# Altium project FIT_PM12_v1.1.PrjPcb (part 12 of 13)
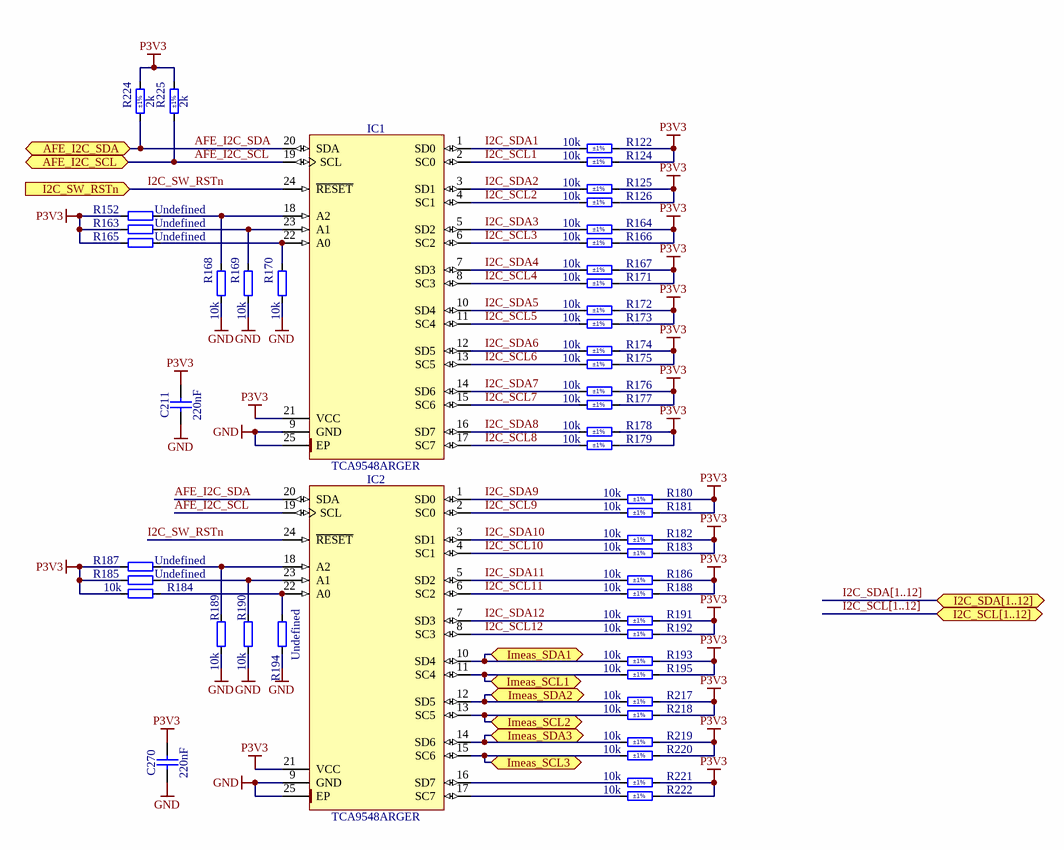
[diagram p35: I2C_Switch.SchDoc]
## Nets that join several sheets
GND: Main_PLL (24 pins), ADCLK (32 pins), PM12_CONN (50 pins), PM12_ATxmega128 (17 pins), PM12_LDO (30 pins), PM12_Supply_LED (22 pins), PM12_P3V8 (19 pins), PM12_P3V3 (15 pins), PM12_N5V5 (10 pins), PM12_P5V5 (23 pins), PM12_P1V0 (15 pins), PM12_P1V8 (15 pins), THS788_1 (35 pins), THS788_3 (35 pins), THS788_2 (35 pins), FPGA_I_J (DD6.P5 DD6.T2 R157.1 R159.1), FPGA_E (60 pins), FPGA_C (21 pins), JTAG (12 pins), FPGA_Power (139 pins), AFE (DD31.3 R4.1 R126#1.1), AFE/INT1 (22 pins), AFE/INT2 (22 pins), AFE/INT3 (22 pins), AFE/INT4 (22 pins), AFE/INT5 (22 pins), AFE/INT6 (22 pins), AFE/INT7 (22 pins), AFE/INT8 (22 pins), AFE/INT9 (22 pins), AFE/INT10 (22 pins), AFE/INT11 (22 pins), AFE/INT12 (22 pins), AFE/ADC1 (22 pins), AFE/ADC2 (22 pins), AFE/ADC3 (22 pins), AFE/ADC4 (22 pins), AFE/ADC5 (22 pins), AFE/ADC6 (22 pins), AFE/ADC7 (22 pins), AFE/ADC8 (22 pins), AFE/ADC9 (22 pins), AFE/ADC10 (22 pins), AFE/ADC11 (22 pins), AFE/ADC12 (22 pins), AFE/CPLD1 (16 pins), AFE/CPLD2 (16 pins), AFE/CPLD3 (16 pins), AFE/CPLD4 (16 pins), AFE/CPLD5 (16 pins), AFE/CPLD6 (16 pins), AFE/CPLD7 (16 pins), AFE/CPLD8 (16 pins), AFE/CPLD9 (16 pins), AFE/CPLD10 (16 pins), AFE/CPLD11 (16 pins), AFE/CPLD12 (16 pins), AFE/QDC1 (15 pins), AFE/QDC2 (14 pins), AFE/QDC3 (14 pins), AFE/QDC4 (13 pins), AFE/QDC5 (15 pins), AFE/QDC6 (14 pins), AFE/QDC7 (14 pins), AFE/QDC8 (13 pins), AFE/QDC9 (15 pins), AFE/QDC10 (14 pins), AFE/QDC11 (14 pins), AFE/QDC12 (13 pins), AFE/ADC_PLL1 (24 pins), AFE/ADC_PLL2 (24 pins), AFE/ADC_PLL3 (24 pins), AFE/ADC_PLL4 (24 pins), AFE/ADC_PLL5 (24 pins), AFE/ADC_PLL6 (24 pins), AFE/ADC_PLL7 (24 pins), AFE/ADC_PLL8 (24 pins), AFE/ADC_PLL9 (24 pins), AFE/ADC_PLL10 (24 pins), AFE/ADC_PLL11 (24 pins), AFE/ADC_PLL12 (24 pins), AFE/Gate_Strobe1 (17 pins), AFE/Gate_Strobe2 (17 pins), AFE/Gate_Strobe3 (17 pins), AFE/Gate_Strobe4 (17 pins), AFE/Gate_Strobe5 (17 pins), AFE/Gate_Strobe6 (17 pins), AFE/Gate_Strobe7 (17 pins), AFE/Gate_Strobe8 (17 pins), AFE/Gate_Strobe9 (17 pins), AFE/Gate_Strobe10 (17 pins), AFE/Gate_Strobe11 (17 pins), AFE/Gate_Strobe12 (17 pins), I2C_Switch (12 pins)
N5V5: PM12_N5V5 (17 pins), PM12_P5V5 (X7.6 X7.7 X7.8)
P1V0: PM12_P1V0 (R74.2), FPGA_Power (27 pins)
P1V0_LDO: PM12_LDO (C78.2 R53.2), FPGA_Power (5 pins)
P1V0_LDO_2: PM12_LDO (C80.2 DA3.4 R53.1), PM12_Supply_LED (R100.1)
P1V2_LDO: PM12_LDO (C84.2 R55.2), FPGA_I_J (DD6.M5 R24.1), FPGA_Power (7 pins)
P1V2_LDO_2: PM12_LDO (C81.2 DA4.4 R55.1), PM12_Supply_LED (R103.1)
P1V8: ADCLK (30 pins), PM12_P1V8 (R84.2), FPGA_Power (52 pins), AFE/CPLD1 (8 pins), AFE/CPLD2 (8 pins), AFE/CPLD3 (8 pins), AFE/CPLD4 (8 pins), AFE/CPLD5 (8 pins), AFE/CPLD6 (8 pins), AFE/CPLD7 (8 pins), AFE/CPLD8 (8 pins), AFE/CPLD9 (8 pins), AFE/CPLD10 (8 pins), AFE/CPLD11 (8 pins), AFE/CPLD12 (8 pins), AFE/Gate_Strobe1 (R3A.2), AFE/Gate_Strobe2 (R3B.2), AFE/Gate_Strobe3 (R3C.2), AFE/Gate_Strobe4 (R3D.2), AFE/Gate_Strobe5 (R3E.2), AFE/Gate_Strobe6 (R3F.2), AFE/Gate_Strobe7 (R3G.2), AFE/Gate_Strobe8 (R3H.2), AFE/Gate_Strobe9 (R3I.2), AFE/Gate_Strobe10 (R3J.2), AFE/Gate_Strobe11 (R3K.2), AFE/Gate_Strobe12 (R3L.2)
P1V8_2: PM12_LDO (L7.1), PM12_P1V8 (7 pins)
P1V8_LDO: PM12_LDO (C86.2 R56.2), FPGA_Power (DD6.N6)
P1V8_LDO_2: PM12_LDO (C85.2 DA5.4 DA5.5 R56.1), PM12_Supply_LED (R106.1)
P3V3: Main_PLL (22 pins), PM12_CONN (12 pins), PM12_ATxmega128 (9 pins), PM12_LDO (13 pins), PM12_Supply_LED (18 pins), PM12_P3V8 (7 pins), PM12_P3V3 (8 pins), PM12_P5V5 (C122.2 DA7.19), PM12_P1V0 (8 pins), PM12_P1V8 (8 pins), THS788_1 (33 pins), THS788_3 (33 pins), THS788_2 (33 pins), FPGA_I_J (DD6.P7 DD6.T5 R156.2 R158.2), FPGA_C (VD1.2 VD2.2 VD3.2 VD7.2), JTAG (5 pins), FPGA_Power (17 pins), AFE (DD31.5 R124#1.2 R125#1.2), AFE/ADC1 (C120A.2 C121A.2 DA10A.24 DA19A.24), AFE/ADC2 (C120B.2 C121B.2 DA10B.24 DA19B.24), AFE/ADC3 (C120C.2 C121C.2 DA10C.24 DA19C.24), AFE/ADC4 (C120D.2 C121D.2 DA10D.24 DA19D.24), AFE/ADC5 (C120E.2 C121E.2 DA10E.24 DA19E.24), AFE/ADC6 (C120F.2 C121F.2 DA10F.24 DA19F.24), AFE/ADC7 (C120G.2 C121G.2 DA10G.24 DA19G.24), AFE/ADC8 (C120H.2 C121H.2 DA10H.24 DA19H.24), AFE/ADC9 (C120I.2 C121I.2 DA10I.24 DA19I.24), AFE/ADC10 (C120J.2 C121J.2 DA10J.24 DA19J.24), AFE/ADC11 (C120K.2 C121K.2 DA10K.24 DA19K.24), AFE/ADC12 (C120L.2 C121L.2 DA10L.24 DA19L.24), AFE/CPLD1 (8 pins), AFE/CPLD2 (8 pins), AFE/CPLD3 (8 pins), AFE/CPLD4 (8 pins), AFE/CPLD5 (8 pins), AFE/CPLD6 (8 pins), AFE/CPLD7 (8 pins), AFE/CPLD8 (8 pins), AFE/CPLD9 (8 pins), AFE/CPLD10 (8 pins), AFE/CPLD11 (8 pins), AFE/CPLD12 (8 pins), AFE/QDC1 (DA22A.12), AFE/QDC2 (DA22B.12 DA22B.13), AFE/QDC3 (DA22C.12 DA22C.14), AFE/QDC4 (DA22D.12 DA22D.13 DA22D.14), AFE/QDC5 (DA22E.12), AFE/QDC6 (DA22F.12 DA22F.13), AFE/QDC7 (DA22G.12 DA22G.14), AFE/QDC8 (DA22H.12 DA22H.13 DA22H.14), AFE/QDC9 (DA22I.12), AFE/QDC10 (DA22J.12 DA22J.13), AFE/QDC11 (DA22K.12 DA22K.14), AFE/QDC12 (DA22L.12 DA22L.13 DA22L.14), AFE/ADC_PLL1 (20 pins), AFE/ADC_PLL2 (20 pins), AFE/ADC_PLL3 (20 pins), AFE/ADC_PLL4 (20 pins), AFE/ADC_PLL5 (20 pins), AFE/ADC_PLL6 (20 pins), AFE/ADC_PLL7 (20 pins), AFE/ADC_PLL8 (20 pins), AFE/ADC_PLL9 (20 pins), AFE/ADC_PLL10 (20 pins), AFE/ADC_PLL11 (20 pins), AFE/ADC_PLL12 (20 pins), AFE/Gate_Strobe1 (9 pins), AFE/Gate_Strobe2 (9 pins), AFE/Gate_Strobe3 (9 pins), AFE/Gate_Strobe4 (9 pins), AFE/Gate_Strobe5 (9 pins), AFE/Gate_Strobe6 (9 pins), AFE/Gate_Strobe7 (9 pins), AFE/Gate_Strobe8 (9 pins), AFE/Gate_Strobe9 (9 pins), AFE/Gate_Strobe10 (9 pins), AFE/Gate_Strobe11 (9 pins), AFE/Gate_Strobe12 (9 pins), I2C_Switch (44 pins)
P3V3_2: PM12_LDO (L8.1), PM12_P3V3 (7 pins)
P3V3_LDO: PM12_CONN (C61.2 C261.2 DD7.16), PM12_ATxmega128 (20 pins), PM12_LDO (C254.1 DA25.3)
P3V8: PM12_P3V8 (C205.1 C267.1 C268.1 L14.2), AFE/Gate_Strobe1 (L1A.1), AFE/Gate_Strobe2 (L1B.1), AFE/Gate_Strobe3 (L1C.1), AFE/Gate_Strobe4 (L1D.1), AFE/Gate_Strobe5 (L1E.1), AFE/Gate_Strobe6 (L1F.1), AFE/Gate_Strobe7 (L1G.1), AFE/Gate_Strobe8 (L1H.1), AFE/Gate_Strobe9 (L1I.1), AFE/Gate_Strobe10 (L1J.1), AFE/Gate_Strobe11 (L1K.1), AFE/Gate_Strobe12 (L1L.1)
VIN_P12V0: PM12_LDO (C2.1 R110.2 X15.4), PM12_N5V5 (5 pins), PM12_P5V5 (C4.2 C118.2 DA7.6 DA7.7)
ADC_CLK: AFE/ADC1 (DA10A.13 DA19A.13), AFE/CPLD1 (DD18A.27), AFE/ADC_PLL1 (DD21A.20)
ADC_CLK: AFE/ADC2 (DA10B.13 DA19B.13), AFE/CPLD2 (DD18B.27), AFE/ADC_PLL2 (DD21B.20)
ADC_CLK: AFE/ADC3 (DA10C.13 DA19C.13), AFE/CPLD3 (DD18C.27), AFE/ADC_PLL3 (DD21C.20)
ADC_CLK: AFE/ADC4 (DA10D.13 DA19D.13), AFE/CPLD4 (DD18D.27), AFE/ADC_PLL4 (DD21D.20)
ADC_CLK: AFE/ADC5 (DA10E.13 DA19E.13), AFE/CPLD5 (DD18E.27), AFE/ADC_PLL5 (DD21E.20)
ADC_CLK: AFE/ADC6 (DA10F.13 DA19F.13), AFE/CPLD6 (DD18F.27), AFE/ADC_PLL6 (DD21F.20)
ADC_CLK: AFE/ADC7 (DA10G.13 DA19G.13), AFE/CPLD7 (DD18G.27), AFE/ADC_PLL7 (DD21G.20)
ADC_CLK: AFE/ADC8 (DA10H.13 DA19H.13), AFE/CPLD8 (DD18H.27), AFE/ADC_PLL8 (DD21H.20)
ADC_CLK: AFE/ADC9 (DA10I.13 DA19I.13), AFE/CPLD9 (DD18I.27), AFE/ADC_PLL9 (DD21I.20)
ADC_CLK: AFE/ADC10 (DA10J.13 DA19J.13), AFE/CPLD10 (DD18J.27), AFE/ADC_PLL10 (DD21J.20)
ADC_CLK: AFE/ADC11 (DA10K.13 DA19K.13), AFE/CPLD11 (DD18K.27), AFE/ADC_PLL11 (DD21K.20)
ADC_CLK: AFE/ADC12 (DA10L.13 DA19L.13), AFE/CPLD12 (DD18L.27), AFE/ADC_PLL12 (DD21L.20)
ADC_CLK_DELAY: AFE/QDC1 (DA22A.1), AFE/ADC_PLL1 (R57A.2)
ADC_CLK_DELAY: AFE/QDC2 (DA22B.1), AFE/ADC_PLL2 (R57B.2)
ADC_CLK_DELAY: AFE/QDC3 (DA22C.1), AFE/ADC_PLL3 (R57C.2)
ADC_CLK_DELAY: AFE/QDC4 (DA22D.1), AFE/ADC_PLL4 (R57D.2)
ADC_CLK_DELAY: AFE/QDC5 (DA22E.1), AFE/ADC_PLL5 (R57E.2)
ADC_CLK_DELAY: AFE/QDC6 (DA22F.1), AFE/ADC_PLL6 (R57F.2)
ADC_CLK_DELAY: AFE/QDC7 (DA22G.1), AFE/ADC_PLL7 (R57G.2)
ADC_CLK_DELAY: AFE/QDC8 (DA22H.1), AFE/ADC_PLL8 (R57H.2)
ADC_CLK_DELAY: AFE/QDC9 (DA22I.1), AFE/ADC_PLL9 (R57I.2)
ADC_CLK_DELAY: AFE/QDC10 (DA22J.1), AFE/ADC_PLL10 (R57J.2)
ADC_CLK_DELAY: AFE/QDC11 (DA22K.1), AFE/ADC_PLL11 (R57K.2)
ADC_CLK_DELAY: AFE/QDC12 (DA22L.1), AFE/ADC_PLL12 (R57L.2)
ADC_PLL_PWRDNB: PM12_ATxmega128 (DD5.19), AFE/ADC_PLL1 (DD21A.12), AFE/ADC_PLL2 (DD21B.12), AFE/ADC_PLL3 (DD21C.12), AFE/ADC_PLL4 (DD21D.12), AFE/ADC_PLL5 (DD21E.12), AFE/ADC_PLL6 (DD21F.12), AFE/ADC_PLL7 (DD21G.12), AFE/ADC_PLL8 (DD21H.12), AFE/ADC_PLL9 (DD21I.12), AFE/ADC_PLL10 (DD21J.12), AFE/ADC_PLL11 (DD21K.12), AFE/ADC_PLL12 (DD21L.12)
ADC_VREF: AFE/ADC1 (C44A.2 C55A.2 DA10A.4 DA19A.4), AFE/QDC1 (5 pins)
ADC_VREF: AFE/ADC2 (C44B.2 C55B.2 DA10B.4 DA19B.4), AFE/QDC2 (5 pins)
ADC_VREF: AFE/ADC3 (C44C.2 C55C.2 DA10C.4 DA19C.4), AFE/QDC3 (5 pins)
ADC_VREF: AFE/ADC4 (C44D.2 C55D.2 DA10D.4 DA19D.4), AFE/QDC4 (5 pins)
ADC_VREF: AFE/ADC5 (C44E.2 C55E.2 DA10E.4 DA19E.4), AFE/QDC5 (5 pins)
ADC_VREF: AFE/ADC6 (C44F.2 C55F.2 DA10F.4 DA19F.4), AFE/QDC6 (5 pins)
ADC_VREF: AFE/ADC7 (C44G.2 C55G.2 DA10G.4 DA19G.4), AFE/QDC7 (5 pins)
ADC_VREF: AFE/ADC8 (C44H.2 C55H.2 DA10H.4 DA19H.4), AFE/QDC8 (5 pins)
ADC_VREF: AFE/ADC9 (C44I.2 C55I.2 DA10I.4 DA19I.4), AFE/QDC9 (5 pins)
ADC_VREF: AFE/ADC10 (C44J.2 C55J.2 DA10J.4 DA19J.4), AFE/QDC10 (5 pins)
ADC_VREF: AFE/ADC11 (C44K.2 C55K.2 DA10K.4 DA19K.4), AFE/QDC11 (5 pins)
ADC_VREF: AFE/ADC12 (C44L.2 C55L.2 DA10L.4 DA19L.4), AFE/QDC12 (5 pins)
ADCA_D0: AFE/ADC1 (DA10A.15), AFE/CPLD1 (DD18A.35)
ADCA_D0: AFE/ADC2 (DA10B.15), AFE/CPLD2 (DD18B.35)
ADCA_D0: AFE/ADC3 (DA10C.15), AFE/CPLD3 (DD18C.35)
ADCA_D0: AFE/ADC4 (DA10D.15), AFE/CPLD4 (DD18D.35)
ADCA_D0: AFE/ADC5 (DA10E.15), AFE/CPLD5 (DD18E.35)
ADCA_D0: AFE/ADC6 (DA10F.15), AFE/CPLD6 (DD18F.35)
ADCA_D0: AFE/ADC7 (DA10G.15), AFE/CPLD7 (DD18G.35)
ADCA_D0: AFE/ADC8 (DA10H.15), AFE/CPLD8 (DD18H.35)
ADCA_D0: AFE/ADC9 (DA10I.15), AFE/CPLD9 (DD18I.35)
ADCA_D0: AFE/ADC10 (DA10J.15), AFE/CPLD10 (DD18J.35)
ADCA_D0: AFE/ADC11 (DA10K.15), AFE/CPLD11 (DD18K.35)
ADCA_D0: AFE/ADC12 (DA10L.15), AFE/CPLD12 (DD18L.35)
ADCA_D1: AFE/ADC1 (DA10A.16), AFE/CPLD1 (DD18A.34)
ADCA_D1: AFE/ADC2 (DA10B.16), AFE/CPLD2 (DD18B.34)
ADCA_D1: AFE/ADC3 (DA10C.16), AFE/CPLD3 (DD18C.34)
ADCA_D1: AFE/ADC4 (DA10D.16), AFE/CPLD4 (DD18D.34)
ADCA_D1: AFE/ADC5 (DA10E.16), AFE/CPLD5 (DD18E.34)
ADCA_D1: AFE/ADC6 (DA10F.16), AFE/CPLD6 (DD18F.34)
ADCA_D1: AFE/ADC7 (DA10G.16), AFE/CPLD7 (DD18G.34)
ADCA_D1: AFE/ADC8 (DA10H.16), AFE/CPLD8 (DD18H.34)
ADCA_D1: AFE/ADC9 (DA10I.16), AFE/CPLD9 (DD18I.34)
ADCA_D1: AFE/ADC10 (DA10J.16), AFE/CPLD10 (DD18J.34)
ADCA_D1: AFE/ADC11 (DA10K.16), AFE/CPLD11 (DD18K.34)
ADCA_D1: AFE/ADC12 (DA10L.16), AFE/CPLD12 (DD18L.34)
ADCA_D2: AFE/ADC1 (DA10A.17), AFE/CPLD1 (DD18A.33)
ADCA_D2: AFE/ADC2 (DA10B.17), AFE/CPLD2 (DD18B.33)
ADCA_D2: AFE/ADC3 (DA10C.17), AFE/CPLD3 (DD18C.33)
ADCA_D2: AFE/ADC4 (DA10D.17), AFE/CPLD4 (DD18D.33)
ADCA_D2: AFE/ADC5 (DA10E.17), AFE/CPLD5 (DD18E.33)
ADCA_D2: AFE/ADC6 (DA10F.17), AFE/CPLD6 (DD18F.33)
ADCA_D2: AFE/ADC7 (DA10G.17), AFE/CPLD7 (DD18G.33)
ADCA_D2: AFE/ADC8 (DA10H.17), AFE/CPLD8 (DD18H.33)
ADCA_D2: AFE/ADC9 (DA10I.17), AFE/CPLD9 (DD18I.33)
ADCA_D2: AFE/ADC10 (DA10J.17), AFE/CPLD10 (DD18J.33)
ADCA_D2: AFE/ADC11 (DA10K.17), AFE/CPLD11 (DD18K.33)
ADCA_D2: AFE/ADC12 (DA10L.17), AFE/CPLD12 (DD18L.33)
ADCA_D3: AFE/ADC1 (DA10A.18), AFE/CPLD1 (DD18A.32)
ADCA_D3: AFE/ADC2 (DA10B.18), AFE/CPLD2 (DD18B.32)
ADCA_D3: AFE/ADC3 (DA10C.18), AFE/CPLD3 (DD18C.32)
ADCA_D3: AFE/ADC4 (DA10D.18), AFE/CPLD4 (DD18D.32)
ADCA_D3: AFE/ADC5 (DA10E.18), AFE/CPLD5 (DD18E.32)
ADCA_D3: AFE/ADC6 (DA10F.18), AFE/CPLD6 (DD18F.32)
ADCA_D3: AFE/ADC7 (DA10G.18), AFE/CPLD7 (DD18G.32)
ADCA_D3: AFE/ADC8 (DA10H.18), AFE/CPLD8 (DD18H.32)
ADCA_D3: AFE/ADC9 (DA10I.18), AFE/CPLD9 (DD18I.32)
ADCA_D3: AFE/ADC10 (DA10J.18), AFE/CPLD10 (DD18J.32)
ADCA_D3: AFE/ADC11 (DA10K.18), AFE/CPLD11 (DD18K.32)
ADCA_D3: AFE/ADC12 (DA10L.18), AFE/CPLD12 (DD18L.32)
ADCA_D4: AFE/ADC1 (DA10A.19), AFE/CPLD1 (DD18A.30)
ADCA_D4: AFE/ADC2 (DA10B.19), AFE/CPLD2 (DD18B.30)
ADCA_D4: AFE/ADC3 (DA10C.19), AFE/CPLD3 (DD18C.30)
ADCA_D4: AFE/ADC4 (DA10D.19), AFE/CPLD4 (DD18D.30)
ADCA_D4: AFE/ADC5 (DA10E.19), AFE/CPLD5 (DD18E.30)
ADCA_D4: AFE/ADC6 (DA10F.19), AFE/CPLD6 (DD18F.30)
ADCA_D4: AFE/ADC7 (DA10G.19), AFE/CPLD7 (DD18G.30)
ADCA_D4: AFE/ADC8 (DA10H.19), AFE/CPLD8 (DD18H.30)
ADCA_D4: AFE/ADC9 (DA10I.19), AFE/CPLD9 (DD18I.30)
ADCA_D4: AFE/ADC10 (DA10J.19), AFE/CPLD10 (DD18J.30)
ADCA_D4: AFE/ADC11 (DA10K.19), AFE/CPLD11 (DD18K.30)
ADCA_D4: AFE/ADC12 (DA10L.19), AFE/CPLD12 (DD18L.30)
ADCA_D5: AFE/ADC1 (DA10A.20), AFE/CPLD1 (DD18A.29)
ADCA_D5: AFE/ADC2 (DA10B.20), AFE/CPLD2 (DD18B.29)
ADCA_D5: AFE/ADC3 (DA10C.20), AFE/CPLD3 (DD18C.29)
ADCA_D5: AFE/ADC4 (DA10D.20), AFE/CPLD4 (DD18D.29)
ADCA_D5: AFE/ADC5 (DA10E.20), AFE/CPLD5 (DD18E.29)
ADCA_D5: AFE/ADC6 (DA10F.20), AFE/CPLD6 (DD18F.29)
ADCA_D5: AFE/ADC7 (DA10G.20), AFE/CPLD7 (DD18G.29)
ADCA_D5: AFE/ADC8 (DA10H.20), AFE/CPLD8 (DD18H.29)
ADCA_D5: AFE/ADC9 (DA10I.20), AFE/CPLD9 (DD18I.29)
ADCA_D5: AFE/ADC10 (DA10J.20), AFE/CPLD10 (DD18J.29)
ADCA_D5: AFE/ADC11 (DA10K.20), AFE/CPLD11 (DD18K.29)
ADCA_D5: AFE/ADC12 (DA10L.20), AFE/CPLD12 (DD18L.29)
ADCA_D6: AFE/ADC1 (DA10A.21), AFE/CPLD1 (DD18A.28)
ADCA_D6: AFE/ADC2 (DA10B.21), AFE/CPLD2 (DD18B.28)
ADCA_D6: AFE/ADC3 (DA10C.21), AFE/CPLD3 (DD18C.28)
ADCA_D6: AFE/ADC4 (DA10D.21), AFE/CPLD4 (DD18D.28)
ADCA_D6: AFE/ADC5 (DA10E.21), AFE/CPLD5 (DD18E.28)
ADCA_D6: AFE/ADC6 (DA10F.21), AFE/CPLD6 (DD18F.28)
ADCA_D6: AFE/ADC7 (DA10G.21), AFE/CPLD7 (DD18G.28)
ADCA_D6: AFE/ADC8 (DA10H.21), AFE/CPLD8 (DD18H.28)
ADCA_D6: AFE/ADC9 (DA10I.21), AFE/CPLD9 (DD18I.28)
ADCA_D6: AFE/ADC10 (DA10J.21), AFE/CPLD10 (DD18J.28)
ADCA_D6: AFE/ADC11 (DA10K.21), AFE/CPLD11 (DD18K.28)
ADCA_D6: AFE/ADC12 (DA10L.21), AFE/CPLD12 (DD18L.28)
ADCA_D7: AFE/ADC1 (DA10A.22), AFE/CPLD1 (DD18A.23)
ADCA_D7: AFE/ADC2 (DA10B.22), AFE/CPLD2 (DD18B.23)
ADCA_D7: AFE/ADC3 (DA10C.22), AFE/CPLD3 (DD18C.23)
ADCA_D7: AFE/ADC4 (DA10D.22), AFE/CPLD4 (DD18D.23)
ADCA_D7: AFE/ADC5 (DA10E.22), AFE/CPLD5 (DD18E.23)
ADCA_D7: AFE/ADC6 (DA10F.22), AFE/CPLD6 (DD18F.23)
ADCA_D7: AFE/ADC7 (DA10G.22), AFE/CPLD7 (DD18G.23)
ADCA_D7: AFE/ADC8 (DA10H.22), AFE/CPLD8 (DD18H.23)
ADCA_D7: AFE/ADC9 (DA10I.22), AFE/CPLD9 (DD18I.23)
ADCA_D7: AFE/ADC10 (DA10J.22), AFE/CPLD10 (DD18J.23)
ADCA_D7: AFE/ADC11 (DA10K.22), AFE/CPLD11 (DD18K.23)
ADCA_D7: AFE/ADC12 (DA10L.22), AFE/CPLD12 (DD18L.23)
ADCA_D8: AFE/ADC1 (DA10A.25), AFE/CPLD1 (DD18A.24)
ADCA_D8: AFE/ADC2 (DA10B.25), AFE/CPLD2 (DD18B.24)
ADCA_D8: AFE/ADC3 (DA10C.25), AFE/CPLD3 (DD18C.24)
ADCA_D8: AFE/ADC4 (DA10D.25), AFE/CPLD4 (DD18D.24)
ADCA_D8: AFE/ADC5 (DA10E.25), AFE/CPLD5 (DD18E.24)
ADCA_D8: AFE/ADC6 (DA10F.25), AFE/CPLD6 (DD18F.24)
ADCA_D8: AFE/ADC7 (DA10G.25), AFE/CPLD7 (DD18G.24)
ADCA_D8: AFE/ADC8 (DA10H.25), AFE/CPLD8 (DD18H.24)
ADCA_D8: AFE/ADC9 (DA10I.25), AFE/CPLD9 (DD18I.24)
ADCA_D8: AFE/ADC10 (DA10J.25), AFE/CPLD10 (DD18J.24)
ADCA_D8: AFE/ADC11 (DA10K.25), AFE/CPLD11 (DD18K.24)
ADCA_D8: AFE/ADC12 (DA10L.25), AFE/CPLD12 (DD18L.24)
ADCA_D9: AFE/ADC1 (DA10A.26), AFE/CPLD1 (DD18A.22)
ADCA_D9: AFE/ADC2 (DA10B.26), AFE/CPLD2 (DD18B.22)
ADCA_D9: AFE/ADC3 (DA10C.26), AFE/CPLD3 (DD18C.22)
ADCA_D9: AFE/ADC4 (DA10D.26), AFE/CPLD4 (DD18D.22)
ADCA_D9: AFE/ADC5 (DA10E.26), AFE/CPLD5 (DD18E.22)
ADCA_D9: AFE/ADC6 (DA10F.26), AFE/CPLD6 (DD18F.22)
ADCA_D9: AFE/ADC7 (DA10G.26), AFE/CPLD7 (DD18G.22)
ADCA_D9: AFE/ADC8 (DA10H.26), AFE/CPLD8 (DD18H.22)
ADCA_D9: AFE/ADC9 (DA10I.26), AFE/CPLD9 (DD18I.22)
ADCA_D9: AFE/ADC10 (DA10J.26), AFE/CPLD10 (DD18J.22)
ADCA_D9: AFE/ADC11 (DA10K.26), AFE/CPLD11 (DD18K.22)
ADCA_D9: AFE/ADC12 (DA10L.26), AFE/CPLD12 (DD18L.22)
ADCA_D10_: AFE/ADC1 (DA10A.27), AFE/CPLD1 (DD18A.19)
ADCA_D10_: AFE/ADC2 (DA10B.27), AFE/CPLD2 (DD18B.19)
ADCA_D10_: AFE/ADC3 (DA10C.27), AFE/CPLD3 (DD18C.19)
ADCA_D10_: AFE/ADC4 (DA10D.27), AFE/CPLD4 (DD18D.19)
ADCA_D10_: AFE/ADC5 (DA10E.27), AFE/CPLD5 (DD18E.19)
ADCA_D10_: AFE/ADC6 (DA10F.27), AFE/CPLD6 (DD18F.19)
ADCA_D10_: AFE/ADC7 (DA10G.27), AFE/CPLD7 (DD18G.19)
ADCA_D10_: AFE/ADC8 (DA10H.27), AFE/CPLD8 (DD18H.19)
ADCA_D10_: AFE/ADC9 (DA10I.27), AFE/CPLD9 (DD18I.19)
ADCA_D10_: AFE/ADC10 (DA10J.27), AFE/CPLD10 (DD18J.19)
ADCA_D10_: AFE/ADC11 (DA10K.27), AFE/CPLD11 (DD18K.19)
ADCA_D10_: AFE/ADC12 (DA10L.27), AFE/CPLD12 (DD18L.19)
ADCA_D11_: AFE/ADC1 (DA10A.28), AFE/CPLD1 (DD18A.18)
ADCA_D11_: AFE/ADC2 (DA10B.28), AFE/CPLD2 (DD18B.18)
ADCA_D11_: AFE/ADC3 (DA10C.28), AFE/CPLD3 (DD18C.18)
ADCA_D11_: AFE/ADC4 (DA10D.28), AFE/CPLD4 (DD18D.18)
ADCA_D11_: AFE/ADC5 (DA10E.28), AFE/CPLD5 (DD18E.18)
ADCA_D11_: AFE/ADC6 (DA10F.28), AFE/CPLD6 (DD18F.18)
ADCA_D11_: AFE/ADC7 (DA10G.28), AFE/CPLD7 (DD18G.18)
ADCA_D11_: AFE/ADC8 (DA10H.28), AFE/CPLD8 (DD18H.18)
ADCA_D11_: AFE/ADC9 (DA10I.28), AFE/CPLD9 (DD18I.18)
ADCA_D11_: AFE/ADC10 (DA10J.28), AFE/CPLD10 (DD18J.18)
ADCA_D11_: AFE/ADC11 (DA10K.28), AFE/CPLD11 (DD18K.18)
ADCA_D11_: AFE/ADC12 (DA10L.28), AFE/CPLD12 (DD18L.18)
ADCA_VIN_N: AFE/INT1 (C154A.2 R12A.2), AFE/ADC1 (DA10A.10)
ADCA_VIN_N: AFE/INT2 (C154B.2 R12B.2), AFE/ADC2 (DA10B.10)
ADCA_VIN_N: AFE/INT3 (C154C.2 R12C.2), AFE/ADC3 (DA10C.10)
ADCA_VIN_N: AFE/INT4 (C154D.2 R12D.2), AFE/ADC4 (DA10D.10)
ADCA_VIN_N: AFE/INT5 (C154E.2 R12E.2), AFE/ADC5 (DA10E.10)
ADCA_VIN_N: AFE/INT6 (C154F.2 R12F.2), AFE/ADC6 (DA10F.10)
ADCA_VIN_N: AFE/INT7 (C154G.2 R12G.2), AFE/ADC7 (DA10G.10)
ADCA_VIN_N: AFE/INT8 (C154H.2 R12H.2), AFE/ADC8 (DA10H.10)
ADCA_VIN_N: AFE/INT9 (C154I.2 R12I.2), AFE/ADC9 (DA10I.10)
ADCA_VIN_N: AFE/INT10 (C154J.2 R12J.2), AFE/ADC10 (DA10J.10)
ADCA_VIN_N: AFE/INT11 (C154K.2 R12K.2), AFE/ADC11 (DA10K.10)
ADCA_VIN_N: AFE/INT12 (C154L.2 R12L.2), AFE/ADC12 (DA10L.10)
ADCA_VIN_P: AFE/INT1 (C153A.2 R11_QCD1A.2), AFE/ADC1 (DA10A.9)
ADCA_VIN_P: AFE/INT2 (C153B.2 R11_QCD1B.2), AFE/ADC2 (DA10B.9)
ADCA_VIN_P: AFE/INT3 (C153C.2 R11_QCD1C.2), AFE/ADC3 (DA10C.9)
ADCA_VIN_P: AFE/INT4 (C153D.2 R11_QCD1D.2), AFE/ADC4 (DA10D.9)
ADCA_VIN_P: AFE/INT5 (C153E.2 R11_QCD1E.2), AFE/ADC5 (DA10E.9)
ADCA_VIN_P: AFE/INT6 (C153F.2 R11_QCD1F.2), AFE/ADC6 (DA10F.9)
ADCA_VIN_P: AFE/INT7 (C153G.2 R11_QCD1G.2), AFE/ADC7 (DA10G.9)
ADCA_VIN_P: AFE/INT8 (C153H.2 R11_QCD1H.2), AFE/ADC8 (DA10H.9)
ADCA_VIN_P: AFE/INT9 (C153I.2 R11_QCD1I.2), AFE/ADC9 (DA10I.9)
ADCA_VIN_P: AFE/INT10 (C153J.2 R11_QCD1J.2), AFE/ADC10 (DA10J.9)
ADCA_VIN_P: AFE/INT11 (C153K.2 R11_QCD1K.2), AFE/ADC11 (DA10K.9)
ADCA_VIN_P: AFE/INT12 (C153L.2 R11_QCD1L.2), AFE/ADC12 (DA10L.9)
ADCB_D0: AFE/ADC1 (DA19A.15), AFE/CPLD1 (DD18A.52)
ADCB_D0: AFE/ADC2 (DA19B.15), AFE/CPLD2 (DD18B.52)
ADCB_D0: AFE/ADC3 (DA19C.15), AFE/CPLD3 (DD18C.52)
ADCB_D0: AFE/ADC4 (DA19D.15), AFE/CPLD4 (DD18D.52)
ADCB_D0: AFE/ADC5 (DA19E.15), AFE/CPLD5 (DD18E.52)
ADCB_D0: AFE/ADC6 (DA19F.15), AFE/CPLD6 (DD18F.52)
ADCB_D0: AFE/ADC7 (DA19G.15), AFE/CPLD7 (DD18G.52)
ADCB_D0: AFE/ADC8 (DA19H.15), AFE/CPLD8 (DD18H.52)
ADCB_D0: AFE/ADC9 (DA19I.15), AFE/CPLD9 (DD18I.52)
ADCB_D0: AFE/ADC10 (DA19J.15), AFE/CPLD10 (DD18J.52)
ADCB_D0: AFE/ADC11 (DA19K.15), AFE/CPLD11 (DD18K.52)
ADCB_D0: AFE/ADC12 (DA19L.15), AFE/CPLD12 (DD18L.52)
ADCB_D1: AFE/ADC1 (DA19A.16), AFE/CPLD1 (DD18A.50)
ADCB_D1: AFE/ADC2 (DA19B.16), AFE/CPLD2 (DD18B.50)
ADCB_D1: AFE/ADC3 (DA19C.16), AFE/CPLD3 (DD18C.50)
ADCB_D1: AFE/ADC4 (DA19D.16), AFE/CPLD4 (DD18D.50)
ADCB_D1: AFE/ADC5 (DA19E.16), AFE/CPLD5 (DD18E.50)
ADCB_D1: AFE/ADC6 (DA19F.16), AFE/CPLD6 (DD18F.50)
ADCB_D1: AFE/ADC7 (DA19G.16), AFE/CPLD7 (DD18G.50)
ADCB_D1: AFE/ADC8 (DA19H.16), AFE/CPLD8 (DD18H.50)
ADCB_D1: AFE/ADC9 (DA19I.16), AFE/CPLD9 (DD18I.50)
ADCB_D1: AFE/ADC10 (DA19J.16), AFE/CPLD10 (DD18J.50)
ADCB_D1: AFE/ADC11 (DA19K.16), AFE/CPLD11 (DD18K.50)
ADCB_D1: AFE/ADC12 (DA19L.16), AFE/CPLD12 (DD18L.50)
ADCB_D2: AFE/ADC1 (DA19A.17), AFE/CPLD1 (DD18A.49)
ADCB_D2: AFE/ADC2 (DA19B.17), AFE/CPLD2 (DD18B.49)
ADCB_D2: AFE/ADC3 (DA19C.17), AFE/CPLD3 (DD18C.49)
ADCB_D2: AFE/ADC4 (DA19D.17), AFE/CPLD4 (DD18D.49)
ADCB_D2: AFE/ADC5 (DA19E.17), AFE/CPLD5 (DD18E.49)
ADCB_D2: AFE/ADC6 (DA19F.17), AFE/CPLD6 (DD18F.49)
ADCB_D2: AFE/ADC7 (DA19G.17), AFE/CPLD7 (DD18G.49)
ADCB_D2: AFE/ADC8 (DA19H.17), AFE/CPLD8 (DD18H.49)
ADCB_D2: AFE/ADC9 (DA19I.17), AFE/CPLD9 (DD18I.49)
ADCB_D2: AFE/ADC10 (DA19J.17), AFE/CPLD10 (DD18J.49)
ADCB_D2: AFE/ADC11 (DA19K.17), AFE/CPLD11 (DD18K.49)
ADCB_D2: AFE/ADC12 (DA19L.17), AFE/CPLD12 (DD18L.49)
ADCB_D3: AFE/ADC1 (DA19A.18), AFE/CPLD1 (DD18A.46)
ADCB_D3: AFE/ADC2 (DA19B.18), AFE/CPLD2 (DD18B.46)
ADCB_D3: AFE/ADC3 (DA19C.18), AFE/CPLD3 (DD18C.46)
ADCB_D3: AFE/ADC4 (DA19D.18), AFE/CPLD4 (DD18D.46)
ADCB_D3: AFE/ADC5 (DA19E.18), AFE/CPLD5 (DD18E.46)
ADCB_D3: AFE/ADC6 (DA19F.18), AFE/CPLD6 (DD18F.46)
ADCB_D3: AFE/ADC7 (DA19G.18), AFE/CPLD7 (DD18G.46)
ADCB_D3: AFE/ADC8 (DA19H.18), AFE/CPLD8 (DD18H.46)
ADCB_D3: AFE/ADC9 (DA19I.18), AFE/CPLD9 (DD18I.46)
ADCB_D3: AFE/ADC10 (DA19J.18), AFE/CPLD10 (DD18J.46)
ADCB_D3: AFE/ADC11 (DA19K.18), AFE/CPLD11 (DD18K.46)
ADCB_D3: AFE/ADC12 (DA19L.18), AFE/CPLD12 (DD18L.46)
ADCB_D4: AFE/ADC1 (DA19A.19), AFE/CPLD1 (DD18A.44)
ADCB_D4: AFE/ADC2 (DA19B.19), AFE/CPLD2 (DD18B.44)
ADCB_D4: AFE/ADC3 (DA19C.19), AFE/CPLD3 (DD18C.44)
ADCB_D4: AFE/ADC4 (DA19D.19), AFE/CPLD4 (DD18D.44)
ADCB_D4: AFE/ADC5 (DA19E.19), AFE/CPLD5 (DD18E.44)
ADCB_D4: AFE/ADC6 (DA19F.19), AFE/CPLD6 (DD18F.44)
ADCB_D4: AFE/ADC7 (DA19G.19), AFE/CPLD7 (DD18G.44)
ADCB_D4: AFE/ADC8 (DA19H.19), AFE/CPLD8 (DD18H.44)
ADCB_D4: AFE/ADC9 (DA19I.19), AFE/CPLD9 (DD18I.44)
ADCB_D4: AFE/ADC10 (DA19J.19), AFE/CPLD10 (DD18J.44)
ADCB_D4: AFE/ADC11 (DA19K.19), AFE/CPLD11 (DD18K.44)
ADCB_D4: AFE/ADC12 (DA19L.19), AFE/CPLD12 (DD18L.44)
ADCB_D5: AFE/ADC1 (DA19A.20), AFE/CPLD1 (DD18A.43)
ADCB_D5: AFE/ADC2 (DA19B.20), AFE/CPLD2 (DD18B.43)
ADCB_D5: AFE/ADC3 (DA19C.20), AFE/CPLD3 (DD18C.43)
ADCB_D5: AFE/ADC4 (DA19D.20), AFE/CPLD4 (DD18D.43)
ADCB_D5: AFE/ADC5 (DA19E.20), AFE/CPLD5 (DD18E.43)
ADCB_D5: AFE/ADC6 (DA19F.20), AFE/CPLD6 (DD18F.43)
ADCB_D5: AFE/ADC7 (DA19G.20), AFE/CPLD7 (DD18G.43)
ADCB_D5: AFE/ADC8 (DA19H.20), AFE/CPLD8 (DD18H.43)
ADCB_D5: AFE/ADC9 (DA19I.20), AFE/CPLD9 (DD18I.43)
ADCB_D5: AFE/ADC10 (DA19J.20), AFE/CPLD10 (DD18J.43)
ADCB_D5: AFE/ADC11 (DA19K.20), AFE/CPLD11 (DD18K.43)
ADCB_D5: AFE/ADC12 (DA19L.20), AFE/CPLD12 (DD18L.43)
ADCB_D6: AFE/ADC1 (DA19A.21), AFE/CPLD1 (DD18A.42)
ADCB_D6: AFE/ADC2 (DA19B.21), AFE/CPLD2 (DD18B.42)
ADCB_D6: AFE/ADC3 (DA19C.21), AFE/CPLD3 (DD18C.42)
ADCB_D6: AFE/ADC4 (DA19D.21), AFE/CPLD4 (DD18D.42)
ADCB_D6: AFE/ADC5 (DA19E.21), AFE/CPLD5 (DD18E.42)
ADCB_D6: AFE/ADC6 (DA19F.21), AFE/CPLD6 (DD18F.42)
ADCB_D6: AFE/ADC7 (DA19G.21), AFE/CPLD7 (DD18G.42)
ADCB_D6: AFE/ADC8 (DA19H.21), AFE/CPLD8 (DD18H.42)
ADCB_D6: AFE/ADC9 (DA19I.21), AFE/CPLD9 (DD18I.42)
ADCB_D6: AFE/ADC10 (DA19J.21), AFE/CPLD10 (DD18J.42)
ADCB_D6: AFE/ADC11 (DA19K.21), AFE/CPLD11 (DD18K.42)
ADCB_D6: AFE/ADC12 (DA19L.21), AFE/CPLD12 (DD18L.42)
ADCB_D7: AFE/ADC1 (DA19A.22), AFE/CPLD1 (DD18A.41)
ADCB_D7: AFE/ADC2 (DA19B.22), AFE/CPLD2 (DD18B.41)
ADCB_D7: AFE/ADC3 (DA19C.22), AFE/CPLD3 (DD18C.41)
ADCB_D7: AFE/ADC4 (DA19D.22), AFE/CPLD4 (DD18D.41)
ADCB_D7: AFE/ADC5 (DA19E.22), AFE/CPLD5 (DD18E.41)
ADCB_D7: AFE/ADC6 (DA19F.22), AFE/CPLD6 (DD18F.41)
ADCB_D7: AFE/ADC7 (DA19G.22), AFE/CPLD7 (DD18G.41)
ADCB_D7: AFE/ADC8 (DA19H.22), AFE/CPLD8 (DD18H.41)
ADCB_D7: AFE/ADC9 (DA19I.22), AFE/CPLD9 (DD18I.41)
ADCB_D7: AFE/ADC10 (DA19J.22), AFE/CPLD10 (DD18J.41)
ADCB_D7: AFE/ADC11 (DA19K.22), AFE/CPLD11 (DD18K.41)
ADCB_D7: AFE/ADC12 (DA19L.22), AFE/CPLD12 (DD18L.41)
ADCB_D8: AFE/ADC1 (DA19A.25), AFE/CPLD1 (DD18A.40)
ADCB_D8: AFE/ADC2 (DA19B.25), AFE/CPLD2 (DD18B.40)
ADCB_D8: AFE/ADC3 (DA19C.25), AFE/CPLD3 (DD18C.40)
ADCB_D8: AFE/ADC4 (DA19D.25), AFE/CPLD4 (DD18D.40)
ADCB_D8: AFE/ADC5 (DA19E.25), AFE/CPLD5 (DD18E.40)
ADCB_D8: AFE/ADC6 (DA19F.25), AFE/CPLD6 (DD18F.40)
ADCB_D8: AFE/ADC7 (DA19G.25), AFE/CPLD7 (DD18G.40)
ADCB_D8: AFE/ADC8 (DA19H.25), AFE/CPLD8 (DD18H.40)
ADCB_D8: AFE/ADC9 (DA19I.25), AFE/CPLD9 (DD18I.40)
ADCB_D8: AFE/ADC10 (DA19J.25), AFE/CPLD10 (DD18J.40)
ADCB_D8: AFE/ADC11 (DA19K.25), AFE/CPLD11 (DD18K.40)
ADCB_D8: AFE/ADC12 (DA19L.25), AFE/CPLD12 (DD18L.40)
ADCB_D9: AFE/ADC1 (DA19A.26), AFE/CPLD1 (DD18A.39)
ADCB_D9: AFE/ADC2 (DA19B.26), AFE/CPLD2 (DD18B.39)
ADCB_D9: AFE/ADC3 (DA19C.26), AFE/CPLD3 (DD18C.39)
ADCB_D9: AFE/ADC4 (DA19D.26), AFE/CPLD4 (DD18D.39)
ADCB_D9: AFE/ADC5 (DA19E.26), AFE/CPLD5 (DD18E.39)
ADCB_D9: AFE/ADC6 (DA19F.26), AFE/CPLD6 (DD18F.39)
ADCB_D9: AFE/ADC7 (DA19G.26), AFE/CPLD7 (DD18G.39)
ADCB_D9: AFE/ADC8 (DA19H.26), AFE/CPLD8 (DD18H.39)
ADCB_D9: AFE/ADC9 (DA19I.26), AFE/CPLD9 (DD18I.39)
ADCB_D9: AFE/ADC10 (DA19J.26), AFE/CPLD10 (DD18J.39)
ADCB_D9: AFE/ADC11 (DA19K.26), AFE/CPLD11 (DD18K.39)
ADCB_D9: AFE/ADC12 (DA19L.26), AFE/CPLD12 (DD18L.39)
ADCB_D10: AFE/ADC1 (DA19A.27), AFE/CPLD1 (DD18A.37)
ADCB_D10: AFE/ADC2 (DA19B.27), AFE/CPLD2 (DD18B.37)
ADCB_D10: AFE/ADC3 (DA19C.27), AFE/CPLD3 (DD18C.37)
ADCB_D10: AFE/ADC4 (DA19D.27), AFE/CPLD4 (DD18D.37)
ADCB_D10: AFE/ADC5 (DA19E.27), AFE/CPLD5 (DD18E.37)
ADCB_D10: AFE/ADC6 (DA19F.27), AFE/CPLD6 (DD18F.37)
ADCB_D10: AFE/ADC7 (DA19G.27), AFE/CPLD7 (DD18G.37)
ADCB_D10: AFE/ADC8 (DA19H.27), AFE/CPLD8 (DD18H.37)
ADCB_D10: AFE/ADC9 (DA19I.27), AFE/CPLD9 (DD18I.37)
ADCB_D10: AFE/ADC10 (DA19J.27), AFE/CPLD10 (DD18J.37)
ADCB_D10: AFE/ADC11 (DA19K.27), AFE/CPLD11 (DD18K.37)
ADCB_D10: AFE/ADC12 (DA19L.27), AFE/CPLD12 (DD18L.37)
ADCB_D11: AFE/ADC1 (DA19A.28), AFE/CPLD1 (DD18A.36)
ADCB_D11: AFE/ADC2 (DA19B.28), AFE/CPLD2 (DD18B.36)
ADCB_D11: AFE/ADC3 (DA19C.28), AFE/CPLD3 (DD18C.36)
ADCB_D11: AFE/ADC4 (DA19D.28), AFE/CPLD4 (DD18D.36)
ADCB_D11: AFE/ADC5 (DA19E.28), AFE/CPLD5 (DD18E.36)
ADCB_D11: AFE/ADC6 (DA19F.28), AFE/CPLD6 (DD18F.36)
ADCB_D11: AFE/ADC7 (DA19G.28), AFE/CPLD7 (DD18G.36)
ADCB_D11: AFE/ADC8 (DA19H.28), AFE/CPLD8 (DD18H.36)
ADCB_D11: AFE/ADC9 (DA19I.28), AFE/CPLD9 (DD18I.36)
ADCB_D11: AFE/ADC10 (DA19J.28), AFE/CPLD10 (DD18J.36)
ADCB_D11: AFE/ADC11 (DA19K.28), AFE/CPLD11 (DD18K.36)
ADCB_D11: AFE/ADC12 (DA19L.28), AFE/CPLD12 (DD18L.36)
ADCB_VIN_N: AFE/INT1 (C156A.2 R29A.2), AFE/ADC1 (DA19A.10)
ADCB_VIN_N: AFE/INT2 (C156B.2 R29B.2), AFE/ADC2 (DA19B.10)
ADCB_VIN_N: AFE/INT3 (C156C.2 R29C.2), AFE/ADC3 (DA19C.10)
ADCB_VIN_N: AFE/INT4 (C156D.2 R29D.2), AFE/ADC4 (DA19D.10)
ADCB_VIN_N: AFE/INT5 (C156E.2 R29E.2), AFE/ADC5 (DA19E.10)
ADCB_VIN_N: AFE/INT6 (C156F.2 R29F.2), AFE/ADC6 (DA19F.10)
ADCB_VIN_N: AFE/INT7 (C156G.2 R29G.2), AFE/ADC7 (DA19G.10)
ADCB_VIN_N: AFE/INT8 (C156H.2 R29H.2), AFE/ADC8 (DA19H.10)
ADCB_VIN_N: AFE/INT9 (C156I.2 R29I.2), AFE/ADC9 (DA19I.10)
ADCB_VIN_N: AFE/INT10 (C156J.2 R29J.2), AFE/ADC10 (DA19J.10)
ADCB_VIN_N: AFE/INT11 (C156K.2 R29K.2), AFE/ADC11 (DA19K.10)
ADCB_VIN_N: AFE/INT12 (C156L.2 R29L.2), AFE/ADC12 (DA19L.10)
ADCB_VIN_P: AFE/INT1 (C155A.2 R25A.2), AFE/ADC1 (DA19A.9)
ADCB_VIN_P: AFE/INT2 (C155B.2 R25B.2), AFE/ADC2 (DA19B.9)
ADCB_VIN_P: AFE/INT3 (C155C.2 R25C.2), AFE/ADC3 (DA19C.9)
ADCB_VIN_P: AFE/INT4 (C155D.2 R25D.2), AFE/ADC4 (DA19D.9)
ADCB_VIN_P: AFE/INT5 (C155E.2 R25E.2), AFE/ADC5 (DA19E.9)
ADCB_VIN_P: AFE/INT6 (C155F.2 R25F.2), AFE/ADC6 (DA19F.9)
ADCB_VIN_P: AFE/INT7 (C155G.2 R25G.2), AFE/ADC7 (DA19G.9)
ADCB_VIN_P: AFE/INT8 (C155H.2 R25H.2), AFE/ADC8 (DA19H.9)
ADCB_VIN_P: AFE/INT9 (C155I.2 R25I.2), AFE/ADC9 (DA19I.9)
ADCB_VIN_P: AFE/INT10 (C155J.2 R25J.2), AFE/ADC10 (DA19J.9)
ADCB_VIN_P: AFE/INT11 (C155K.2 R25K.2), AFE/ADC11 (DA19K.9)
ADCB_VIN_P: AFE/INT12 (C155L.2 R25L.2), AFE/ADC12 (DA19L.9)
BUCK_SYNC: PM12_LDO (R73.2), PM12_P3V8 (DA23.1), PM12_P3V3 (DA13.1), PM12_N5V5 (DA8.10), PM12_P5V5 (DA7.10), PM12_P1V0 (DA11.1), PM12_P1V8 (DA12.1)
CFD_OUT: AFE/CPLD1 (DD18A.63), AFE/Gate_Strobe1 (DD1A.7)
CFD_OUT: AFE/CPLD2 (DD18B.63), AFE/Gate_Strobe2 (DD1B.7)
CFD_OUT: AFE/CPLD3 (DD18C.63), AFE/Gate_Strobe3 (DD1C.7)
CFD_OUT: AFE/CPLD4 (DD18D.63), AFE/Gate_Strobe4 (DD1D.7)
CFD_OUT: AFE/CPLD5 (DD18E.63), AFE/Gate_Strobe5 (DD1E.7)
CFD_OUT: AFE/CPLD6 (DD18F.63), AFE/Gate_Strobe6 (DD1F.7)
CFD_OUT: AFE/CPLD7 (DD18G.63), AFE/Gate_Strobe7 (DD1G.7)
CFD_OUT: AFE/CPLD8 (DD18H.63), AFE/Gate_Strobe8 (DD1H.7)
CFD_OUT: AFE/CPLD9 (DD18I.63), AFE/Gate_Strobe9 (DD1I.7)
CFD_OUT: AFE/CPLD10 (DD18J.63), AFE/Gate_Strobe10 (DD1J.7)
CFD_OUT: AFE/CPLD11 (DD18K.63), AFE/Gate_Strobe11 (DD1K.7)
CFD_OUT: AFE/CPLD12 (DD18L.63), AFE/Gate_Strobe12 (DD1L.7)
CFG_CCLK: PM12_ATxmega128 (DD5.43 DD9.6), FPGA_I_J (DD6.C8)
CFG_DIN_DQ1: PM12_ATxmega128 (DD5.42 DD9.2), FPGA_C (DD6.A25)
CFG_DQ2: PM12_ATxmega128 (DD9.3 R36.1), FPGA_C (DD6.B22)
CFG_DQ3: PM12_ATxmega128 (DD9.7 R30.1), FPGA_C (DD6.A22)
CFG_FCS: PM12_ATxmega128 (DD5.40 DD9.1 R26.1), FPGA_C (DD6.C23)
CFG_MOSI_DQO: PM12_ATxmega128 (DD5.41 DD9.5), FPGA_C (DD6.B24)
CPLD_TCK: JTAG (R8.2), AFE (R124#1.1 R126#1.2), AFE/CPLD1 (DD18A.48), AFE/CPLD2 (DD18B.48), AFE/CPLD3 (DD18C.48), AFE/CPLD4 (DD18D.48), AFE/CPLD5 (DD18E.48), AFE/CPLD6 (DD18F.48), AFE/CPLD7 (DD18G.48), AFE/CPLD8 (DD18H.48), AFE/CPLD9 (DD18I.48), AFE/CPLD10 (DD18J.48), AFE/CPLD11 (DD18K.48), AFE/CPLD12 (DD18L.48)
CPLD_TDI: JTAG (R128.2), AFE/CPLD1 (DD18A.45)
CPLD_TDI: AFE/CPLD1 (DD18A.83), AFE/CPLD2 (DD18B.45)
CPLD_TDI: AFE/CPLD2 (DD18B.83), AFE/CPLD3 (DD18C.45)
CPLD_TDI: AFE/CPLD3 (DD18C.83), AFE/CPLD4 (DD18D.45)
CPLD_TDI: AFE/CPLD4 (DD18D.83), AFE/CPLD5 (DD18E.45)
CPLD_TDI: AFE/CPLD5 (DD18E.83), AFE/CPLD6 (DD18F.45)
CPLD_TDI: AFE/CPLD6 (DD18F.83), AFE/CPLD7 (DD18G.45)
CPLD_TDI: AFE/CPLD7 (DD18G.83), AFE/CPLD8 (DD18H.45)
CPLD_TDI: AFE/CPLD8 (DD18H.83), AFE/CPLD9 (DD18I.45)
CPLD_TDI: AFE/CPLD9 (DD18I.83), AFE/CPLD10 (DD18J.45)
CPLD_TDI: AFE/CPLD10 (DD18J.83), AFE/CPLD11 (DD18K.45)
CPLD_TDI: AFE/CPLD11 (DD18K.83), AFE/CPLD12 (DD18L.45)
CPLD_TDO: FPGA_I_J (R154.1), AFE/CPLD12 (DD18L.83)
CPLD_TMS: JTAG (R7.2), AFE (R4.2 R125#1.1), AFE/CPLD1 (DD18A.47), AFE/CPLD2 (DD18B.47), AFE/CPLD3 (DD18C.47), AFE/CPLD4 (DD18D.47), AFE/CPLD5 (DD18E.47), AFE/CPLD6 (DD18F.47), AFE/CPLD7 (DD18G.47), AFE/CPLD8 (DD18H.47), AFE/CPLD9 (DD18I.47), AFE/CPLD10 (DD18J.47), AFE/CPLD11 (DD18K.47), AFE/CPLD12 (DD18L.47)
CS: PM12_ATxmega128 (DD5.26), FPGA_C (DD6.E26)
DAC_SYNC: PM12_ATxmega128 (DD5.16), AFE/QDC1 (DA22A.9), AFE/QDC2 (DA22B.9), AFE/QDC3 (DA22C.9), AFE/QDC4 (DA22D.9)
DAC_SYNC: PM12_ATxmega128 (DD5.17), AFE/QDC5 (DA22E.9), AFE/QDC6 (DA22F.9), AFE/QDC7 (DA22G.9), AFE/QDC8 (DA22H.9)
DAC_SYNC: PM12_ATxmega128 (DD5.18), AFE/QDC9 (DA22I.9), AFE/QDC10 (DA22J.9), AFE/QDC11 (DA22K.9), AFE/QDC12 (DA22L.9)
DI0_: FPGA_H (DD6.AF4), AFE/CPLD2 (DD18B.99)
DI0_: FPGA_H (DD6.T7), AFE/CPLD1 (DD18A.99)
DI0_: FPGA_D_F (DD6.AE20), AFE/CPLD5 (DD18E.99)
DI0_: FPGA_D_F (DD6.V18), AFE/CPLD4 (DD18D.99)
DI0_: FPGA_A_B (DD6.V21), AFE/CPLD8 (DD18H.99)
DI0_: FPGA_A_B (DD6.AA24), AFE/CPLD7 (DD18G.99)
DI0_: FPGA_A_B (DD6.AD25), AFE/CPLD6 (DD18F.99)
DI0_: FPGA_A_B (DD6.L24), AFE/CPLD12 (DD18L.99)
DI0_: FPGA_A_B (DD6.R23), AFE/CPLD10 (DD18J.99)
DI0_: FPGA_A_B (DD6.N18), AFE/CPLD11 (DD18K.99)
DI0_: FPGA_A_B (DD6.T17), AFE/CPLD9 (DD18I.99)
DI0_: FPGA_G (DD6.AA8), AFE/CPLD3 (DD18C.99)
DI1_: FPGA_H (DD6.U7), AFE/CPLD1 (DD18A.97)
DI1_: FPGA_H (DD6.AD5), AFE/CPLD2 (DD18B.97)
DI1_: FPGA_D_F (DD6.AF20), AFE/CPLD5 (DD18E.97)
DI1_: FPGA_D_F (DD6.W18), AFE/CPLD4 (DD18D.97)
DI1_: FPGA_A_B (DD6.V22), AFE/CPLD8 (DD18H.97)
DI1_: FPGA_A_B (DD6.AA25), AFE/CPLD7 (DD18G.97)
DI1_: FPGA_A_B (DD6.AD26), AFE/CPLD6 (DD18F.97)
DI1_: FPGA_A_B (DD6.L25), AFE/CPLD12 (DD18L.97)
DI1_: FPGA_A_B (DD6.R25), AFE/CPLD10 (DD18J.97)
DI1_: FPGA_A_B (DD6.N19), AFE/CPLD11 (DD18K.97)
DI1_: FPGA_A_B (DD6.T18), AFE/CPLD9 (DD18I.97)
DI1_: FPGA_G (DD6.AD11), AFE/CPLD3 (DD18C.97)
DI2_: FPGA_H (DD6.U6), AFE/CPLD1 (DD18A.96)
DI2_: FPGA_H (DD6.AE5), AFE/CPLD2 (DD18B.96)
DI2_: FPGA_D_F (DD6.AA19), AFE/CPLD4 (DD18D.96)
DI2_: FPGA_A_B (DD6.V23), AFE/CPLD8 (DD18H.96)
DI2_: FPGA_A_B (DD6.AC21), AFE/CPLD6 (DD18F.96)
DI2_: FPGA_A_B (DD6.AE21), AFE/CPLD5 (DD18E.96)
DI2_: FPGA_A_B (DD6.Y20), AFE/CPLD7 (DD18G.96)
DI2_: FPGA_A_B (DD6.K25), AFE/CPLD12 (DD18L.96)
DI2_: FPGA_A_B (DD6.R26), AFE/CPLD10 (DD18J.96)
DI2_: FPGA_A_B (DD6.N21), AFE/CPLD11 (DD18K.96)
DI2_: FPGA_A_B (DD6.T19), AFE/CPLD9 (DD18I.96)
DI2_: FPGA_G (DD6.AE11), AFE/CPLD3 (DD18C.96)
DI3_: FPGA_H (DD6.U5), AFE/CPLD1 (DD18A.95)
DI3_: FPGA_H (DD6.AF5), AFE/CPLD2 (DD18B.95)
DI3_: FPGA_D_F (DD6.AC19), AFE/CPLD4 (DD18D.95)
DI3_: FPGA_A_B (DD6.V24), AFE/CPLD8 (DD18H.95)
DI3_: FPGA_A_B (DD6.Y21), AFE/CPLD7 (DD18G.95)
DI3_: FPGA_A_B (DD6.AC22), AFE/CPLD6 (DD18F.95)
DI3_: FPGA_A_B (DD6.AF22), AFE/CPLD5 (DD18E.95)
DI3_: FPGA_A_B (DD6.K26), AFE/CPLD12 (DD18L.95)
DI3_: FPGA_A_B (DD6.N22), AFE/CPLD11 (DD18K.95)
DI3_: FPGA_A_B (DD6.T20), AFE/CPLD9 (DD18I.95)
DI3_: FPGA_A_B (DD6.P16), AFE/CPLD10 (DD18J.95)
DI3_: FPGA_G (DD6.V12), AFE/CPLD3 (DD18C.95)
DI4_: FPGA_H (DD6.U4), AFE/CPLD1 (DD18A.94)
DI4_: FPGA_H (DD6.AB6), AFE/CPLD2 (DD18B.94)
DI4_: FPGA_D_F (DD6.M16), AFE/CPLD12 (DD18L.94)
DI4_: FPGA_D_F (DD6.AE18), AFE/CPLD4 (DD18D.94)
DI4_: FPGA_A_B (DD6.V26), AFE/CPLD8 (DD18H.94)
DI4_: FPGA_A_B (DD6.Y22), AFE/CPLD7 (DD18G.94)
DI4_: FPGA_A_B (DD6.AC23), AFE/CPLD6 (DD18F.94)
DI4_: FPGA_A_B (DD6.AE22), AFE/CPLD5 (DD18E.94)
DI4_: FPGA_A_B (DD6.N23), AFE/CPLD11 (DD18K.94)
DI4_: FPGA_A_B (DD6.T22), AFE/CPLD9 (DD18I.94)
DI4_: FPGA_A_B (DD6.P18), AFE/CPLD10 (DD18J.94)
DI4_: FPGA_G (DD6.Y12), AFE/CPLD3 (DD18C.94)
DI5_: FPGA_H (DD6.U2), AFE/CPLD1 (DD18A.93)
DI5_: FPGA_H (DD6.AC6), AFE/CPLD2 (DD18B.93)
DI5_: FPGA_D_F (DD6.M17), AFE/CPLD12 (DD18L.93)
DI5_: FPGA_D_F (DD6.AF18), AFE/CPLD4 (DD18D.93)
DI5_: FPGA_A_B (DD6.U21), AFE/CPLD8 (DD18H.93)
DI5_: FPGA_A_B (DD6.Y23), AFE/CPLD7 (DD18G.93)
DI5_: FPGA_A_B (DD6.AD24), AFE/CPLD6 (DD18F.93)
DI5_: FPGA_A_B (DD6.AF23), AFE/CPLD5 (DD18E.93)
DI5_: FPGA_A_B (DD6.N24), AFE/CPLD11 (DD18K.93)
DI5_: FPGA_A_B (DD6.P19), AFE/CPLD10 (DD18J.93)
DI5_: FPGA_A_B (DD6.T23), AFE/CPLD9 (DD18I.93)
DI5_: FPGA_G (DD6.Y13), AFE/CPLD3 (DD18C.93)
DI6_: FPGA_H (DD6.U1), AFE/CPLD1 (DD18A.92)
DI6_: FPGA_H (DD6.AD6), AFE/CPLD2 (DD18B.92)
DI6_: FPGA_D_F (DD6.L17), AFE/CPLD12 (DD18L.92)
DI6_: FPGA_D_F (DD6.AB20), AFE/CPLD4 (DD18D.92)
DI6_: FPGA_A_B (DD6.U22), AFE/CPLD8 (DD18H.92)
DI6_: FPGA_A_B (DD6.AC26), AFE/CPLD6 (DD18F.92)
DI6_: FPGA_A_B (DD6.Y25), AFE/CPLD7 (DD18G.92)
DI6_: FPGA_A_B (DD6.AE23), AFE/CPLD5 (DD18E.92)
DI6_: FPGA_A_B (DD6.N26), AFE/CPLD11 (DD18K.92)
DI6_: FPGA_A_B (DD6.P20), AFE/CPLD10 (DD18J.92)
DI6_: FPGA_A_B (DD6.T24), AFE/CPLD9 (DD18I.92)
DI6_: FPGA_G (DD6.AA12), AFE/CPLD3 (DD18C.92)
DI7_: FPGA_H (DD6.V6), AFE/CPLD1 (DD18A.91)
DI7_: FPGA_H (DD6.AE6), AFE/CPLD2 (DD18B.91)
DI7_: FPGA_D_F (DD6.L18), AFE/CPLD12 (DD18L.91)
DI7_: FPGA_D_F (DD6.V19), AFE/CPLD4 (DD18D.91)
DI7_: FPGA_A_B (DD6.U24), AFE/CPLD8 (DD18H.91)
DI7_: FPGA_A_B (DD6.Y26), AFE/CPLD7 (DD18G.91)
DI7_: FPGA_A_B (DD6.AC24), AFE/CPLD6 (DD18F.91)
DI7_: FPGA_A_B (DD6.AF24), AFE/CPLD5 (DD18E.91)
DI7_: FPGA_A_B (DD6.P21), AFE/CPLD10 (DD18J.91)
DI7_: FPGA_A_B (DD6.T25), AFE/CPLD9 (DD18I.91)
DI7_: FPGA_A_B (DD6.M19), AFE/CPLD11 (DD18K.91)
DI7_: FPGA_G (DD6.AA13), AFE/CPLD3 (DD18C.91)
DI8_: FPGA_H (DD6.V4), AFE/CPLD1 (DD18A.90)
DI8_: FPGA_D_F (DD6.L19), AFE/CPLD12 (DD18L.90)
DI8_: FPGA_D_F (DD6.V13), AFE/CPLD3 (DD18C.90)
DI8_: FPGA_D_F (DD6.W19), AFE/CPLD4 (DD18D.90)
DI8_: FPGA_A_B (DD6.U25), AFE/CPLD8 (DD18H.90)
DI8_: FPGA_A_B (DD6.W20), AFE/CPLD7 (DD18G.90)
DI8_: FPGA_A_B (DD6.AB22), AFE/CPLD6 (DD18F.90)
DI8_: FPGA_A_B (DD6.AF25), AFE/CPLD5 (DD18E.90)
DI8_: FPGA_A_B (DD6.M20), AFE/CPLD11 (DD18K.90)
DI8_: FPGA_A_B (DD6.P23), AFE/CPLD10 (DD18J.90)
DI8_: FPGA_A_B (DD6.R16), AFE/CPLD9 (DD18I.90)
DI8_: FPGA_G (DD6.U9), AFE/CPLD2 (DD18B.90)
DI9_: FPGA_H (DD6.W4), AFE/CPLD1 (DD18A.89)
DI9_: FPGA_D_F (DD6.L20), AFE/CPLD12 (DD18L.89)
DI9_: FPGA_D_F (DD6.AB19), AFE/CPLD4 (DD18D.89)
DI9_: FPGA_D_F (DD6.W13), AFE/CPLD3 (DD18C.89)
DI9_: FPGA_A_B (DD6.U26), AFE/CPLD8 (DD18H.89)
DI9_: FPGA_A_B (DD6.W21), AFE/CPLD7 (DD18G.89)
DI9_: FPGA_A_B (DD6.AB24), AFE/CPLD6 (DD18F.89)
DI9_: FPGA_A_B (DD6.AE25), AFE/CPLD5 (DD18E.89)
DI9_: FPGA_A_B (DD6.P24), AFE/CPLD10 (DD18J.89)
DI9_: FPGA_A_B (DD6.M21), AFE/CPLD11 (DD18K.89)
DI9_: FPGA_A_B (DD6.R17), AFE/CPLD9 (DD18I.89)
DI9_: FPGA_G (DD6.V7), AFE/CPLD2 (DD18B.89)
DI10_: FPGA_H (DD6.V2), AFE/CPLD1 (DD18A.87)
DI10_: FPGA_D_F (DD6.K18), AFE/CPLD12 (DD18L.87)
DI10_: FPGA_D_F (DD6.AD19), AFE/CPLD4 (DD18D.87)
DI10_: FPGA_D_F (DD6.V14), AFE/CPLD3 (DD18C.87)
DI10_: FPGA_A_B (DD6.AB25), AFE/CPLD6 (DD18F.87)
DI10_: FPGA_A_B (DD6.W23), AFE/CPLD7 (DD18G.87)
DI10_: FPGA_A_B (DD6.AE26), AFE/CPLD5 (DD18E.87)
DI10_: FPGA_A_B (DD6.P25), AFE/CPLD10 (DD18J.87)
DI10_: FPGA_A_B (DD6.M22), AFE/CPLD11 (DD18K.87)
DI10_: FPGA_A_B (DD6.R18), AFE/CPLD9 (DD18I.87)
DI10_: FPGA_A_B (DD6.U16), AFE/CPLD8 (DD18H.87)
DI10_: FPGA_G (DD6.V8), AFE/CPLD2 (DD18B.87)
DI11_: FPGA_H (DD6.V1), AFE/CPLD1 (DD18A.86)
DI11_: FPGA_D_F (DD6.K16), AFE/CPLD12 (DD18L.86)
DI11_: FPGA_D_F (DD6.AF19), AFE/CPLD4 (DD18D.86)
DI11_: FPGA_D_F (DD6.W14), AFE/CPLD3 (DD18C.86)
DI11_: FPGA_A_B (DD6.W24), AFE/CPLD7 (DD18G.86)
DI11_: FPGA_A_B (DD6.AB26), AFE/CPLD6 (DD18F.86)
DI11_: FPGA_A_B (DD6.AD21), AFE/CPLD5 (DD18E.86)
DI11_: FPGA_A_B (DD6.P26), AFE/CPLD10 (DD18J.86)
DI11_: FPGA_A_B (DD6.M24), AFE/CPLD11 (DD18K.86)
DI11_: FPGA_A_B (DD6.R20), AFE/CPLD9 (DD18I.86)
DI11_: FPGA_A_B (DD6.U17), AFE/CPLD8 (DD18H.86)
DI11_: FPGA_G (DD6.Y7), AFE/CPLD2 (DD18B.86)
DI12_: FPGA_H (DD6.W6), AFE/CPLD1 (DD18A.85)
DI12_: FPGA_D_F (DD6.K17), AFE/CPLD12 (DD18L.85)
DI12_: FPGA_D_F (DD6.AA14), AFE/CPLD3 (DD18C.85)
DI12_: FPGA_D_F (DD6.AA20), AFE/CPLD4 (DD18D.85)
DI12_: FPGA_A_B (DD6.W25), AFE/CPLD7 (DD18G.85)
DI12_: FPGA_A_B (DD6.AA22), AFE/CPLD6 (DD18F.85)
DI12_: FPGA_A_B (DD6.AD23), AFE/CPLD5 (DD18E.85)
DI12_: FPGA_A_B (DD6.N16), AFE/CPLD10 (DD18J.85)
DI12_: FPGA_A_B (DD6.M25), AFE/CPLD11 (DD18K.85)
DI12_: FPGA_A_B (DD6.R21), AFE/CPLD9 (DD18I.85)
DI12_: FPGA_A_B (DD6.U19), AFE/CPLD8 (DD18H.85)
DI12_: FPGA_G (DD6.Y8), AFE/CPLD2 (DD18B.85)
EN_P1V0: PM12_Supply_LED (DD11.3 DD11.5 DD11.9 DD11.12), PM12_P1V0 (DA11.3)
EN_P1V8LDO_P1V2LDO: PM12_LDO (DA4.1 DA5.1), PM12_Supply_LED (DD11.8)
EN_P3V3_P1V0LDO: PM12_LDO (DA3.1), PM12_Supply_LED (DD11.11), PM12_P3V3 (DA13.3)
EN_P5V5_P3V8_P1V8_N5V5: PM12_Supply_LED (DD11.6), PM12_P3V8 (DA23.3), PM12_N5V5 (DA8.8), PM12_P5V5 (DA7.8), PM12_P1V8 (DA12.3)
EN_PSU: PM12_ATxmega128 (DD5.38), PM12_Supply_LED (DD11.1 DD12.4 R150.2)
EV_IN_: PM12_ATxmega128 (DD5.20), FPGA_C (DD6.F23), AFE/CPLD12 (DD18L.60)
EV_IN_: AFE/CPLD1 (DD18A.60), AFE/CPLD2 (DD18B.16)
EV_IN_: AFE/CPLD2 (DD18B.60), AFE/CPLD3 (DD18C.16)
EV_IN_: AFE/CPLD3 (DD18C.60), AFE/CPLD4 (DD18D.16)
EV_IN_: AFE/CPLD4 (DD18D.60), AFE/CPLD5 (DD18E.16)
EV_IN_: AFE/CPLD5 (DD18E.60), AFE/CPLD6 (DD18F.16)
EV_IN_: AFE/CPLD6 (DD18F.60), AFE/CPLD7 (DD18G.16)
EV_IN_: AFE/CPLD7 (DD18G.60), AFE/CPLD8 (DD18H.16)
EV_IN_: AFE/CPLD8 (DD18H.60), AFE/CPLD9 (DD18I.16)
EV_IN_: AFE/CPLD9 (DD18I.60), AFE/CPLD10 (DD18J.16)
EV_IN_: AFE/CPLD10 (DD18J.60), AFE/CPLD11 (DD18K.16)
EV_IN_: AFE/CPLD11 (DD18K.60), AFE/CPLD12 (DD18L.16)
Event_N: FPGA_H (DD6.Y2), THS788_1 (DD4.63), AFE/Gate_Strobe2 (DD17B.6)
Event_N: FPGA_H (DD6.Y1), THS788_1 (DD4.66), AFE/Gate_Strobe1 (DD17A.6)
Event_N: FPGA_H (DD6.AD3), THS788_1 (DD4.13), AFE/Gate_Strobe4 (DD17D.6)
Event_N: FPGA_H (DD6.AE1), THS788_1 (DD4.10), AFE/Gate_Strobe3 (DD17C.6)
Event_N: FPGA_D_F (DD6.AF15), THS788_3 (DD25.66), AFE/Gate_Strobe9 (DD17I.6)
Event_N: FPGA_D_F (DD6.AA18), THS788_3 (DD25.10), AFE/Gate_Strobe11 (DD17K.6)
Event_N: FPGA_D_F (DD6.Y18), THS788_3 (DD25.13), AFE/Gate_Strobe12 (DD17L.6)
Event_N: FPGA_D_F (DD6.W16), THS788_3 (DD25.63), AFE/Gate_Strobe10 (DD17J.6)
Event_N: FPGA_G (DD6.W8), THS788_2 (DD24.63), AFE/Gate_Strobe6 (DD17F.6)
Event_N: FPGA_G (DD6.AD8), THS788_2 (DD24.66), AFE/Gate_Strobe5 (DD17E.6)
Event_N: FPGA_G (DD6.AE10), THS788_2 (DD24.10), AFE/Gate_Strobe7 (DD17G.6)
Event_N: FPGA_G (DD6.AF9), THS788_2 (DD24.13), AFE/Gate_Strobe8 (DD17H.6)
Event_P: FPGA_H (DD6.Y3), THS788_1 (DD4.61), AFE/Gate_Strobe2 (DD17B.7)
Event_P: FPGA_H (DD6.W1), THS788_1 (DD4.68), AFE/Gate_Strobe1 (DD17A.7)
Event_P: FPGA_H (DD6.AD4), THS788_1 (DD4.15), AFE/Gate_Strobe4 (DD17D.7)
Event_P: FPGA_H (DD6.AD1), THS788_1 (DD4.8), AFE/Gate_Strobe3 (DD17C.7)
Event_P: FPGA_D_F (DD6.AF14), THS788_3 (DD25.68), AFE/Gate_Strobe9 (DD17I.7)
Event_P: FPGA_D_F (DD6.AA17), THS788_3 (DD25.8), AFE/Gate_Strobe11 (DD17K.7)
Event_P: FPGA_D_F (DD6.Y17), THS788_3 (DD25.15), AFE/Gate_Strobe12 (DD17L.7)
Event_P: FPGA_D_F (DD6.W15), THS788_3 (DD25.61), AFE/Gate_Strobe10 (DD17J.7)
Event_P: FPGA_G (DD6.V9), THS788_2 (DD24.61), AFE/Gate_Strobe6 (DD17F.7)
Event_P: FPGA_G (DD6.AC8), THS788_2 (DD24.68), AFE/Gate_Strobe5 (DD17E.7)
Event_P: FPGA_G (DD6.AD10), THS788_2 (DD24.8), AFE/Gate_Strobe7 (DD17G.7)
Event_P: FPGA_G (DD6.AF10), THS788_2 (DD24.15), AFE/Gate_Strobe8 (DD17H.7)
FMC_HDMI_PM_DA0_N: PM12_CONN (X9.12), FPGA_G (DD6.AC12)
FMC_HDMI_PM_DA0_P: PM12_CONN (X9.10), FPGA_G (DD6.AB12)
FMC_HDMI_PM_DA1_N: PM12_CONN (X9.9), FPGA_G (DD6.AF12)
FMC_HDMI_PM_DA1_P: PM12_CONN (X9.7), FPGA_G (DD6.AE12)
FMC_HDMI_PM_DT0_N: PM12_CONN (X9.6), FPGA_G (DD6.AF13)
FMC_HDMI_PM_DT0_P: PM12_CONN (X9.4), FPGA_G (DD6.AE13)
FMC_HDMI_PM_DT1_N: PM12_CONN (X9.3), FPGA_G (DD6.AD13)
FMC_HDMI_PM_DT1_P: PM12_CONN (X9.1), FPGA_G (DD6.AC13)
FPGA_DONE: PM12_ATxmega128 (DD5.29 R23.1), PM12_Supply_LED (DD13.12 DD13.13), FPGA_I_J (DD6.J7)
FPGA_INIT_B: PM12_ATxmega128 (DD5.28 R22.1), FPGA_I_J (DD6.G7)
FPGA_PROGRAM_B: PM12_ATxmega128 (DD5.27 R21.1), FPGA_I_J (DD6.P6)
FPGA_TCK: FPGA_I_J (DD6.L8 R158.1 R159.2), JTAG (R136.2)
FPGA_TDO: FPGA_I_J (R155.1), JTAG (DD22.5 DD22.6)
FPGA_TMS: FPGA_I_J (DD6.N8 R156.1 R157.2), JTAG (R135.2)
Gate_STR1_i: AFE/CPLD1 (DD18A.81), AFE/Gate_Strobe1 (C1A.1 R1A.1 R9A.1)
Gate_STR1_i: AFE/CPLD2 (DD18B.81), AFE/Gate_Strobe2 (C1B.1 R1B.1 R9B.1)
Gate_STR1_i: AFE/CPLD3 (DD18C.81), AFE/Gate_Strobe3 (C1C.1 R1C.1 R9C.1)
Gate_STR1_i: AFE/CPLD4 (DD18D.81), AFE/Gate_Strobe4 (C1D.1 R1D.1 R9D.1)
Gate_STR1_i: AFE/CPLD5 (DD18E.81), AFE/Gate_Strobe5 (C1E.1 R1E.1 R9E.1)
Gate_STR1_i: AFE/CPLD6 (DD18F.81), AFE/Gate_Strobe6 (C1F.1 R1F.1 R9F.1)
Gate_STR1_i: AFE/CPLD7 (DD18G.81), AFE/Gate_Strobe7 (C1G.1 R1G.1 R9G.1)
Gate_STR1_i: AFE/CPLD8 (DD18H.81), AFE/Gate_Strobe8 (C1H.1 R1H.1 R9H.1)
Gate_STR1_i: AFE/CPLD9 (DD18I.81), AFE/Gate_Strobe9 (C1I.1 R1I.1 R9I.1)
Gate_STR1_i: AFE/CPLD10 (DD18J.81), AFE/Gate_Strobe10 (C1J.1 R1J.1 R9J.1)
Gate_STR1_i: AFE/CPLD11 (DD18K.81), AFE/Gate_Strobe11 (C1K.1 R1K.1 R9K.1)
Gate_STR1_i: AFE/CPLD12 (DD18L.81), AFE/Gate_Strobe12 (C1L.1 R1L.1 R9L.1)
Gate_STR1_o: AFE/CPLD1 (DD18A.64), AFE/Gate_Strobe1 (DD1A.6)
Gate_STR1_o: AFE/CPLD2 (DD18B.64), AFE/Gate_Strobe2 (DD1B.6)
Gate_STR1_o: AFE/CPLD3 (DD18C.64), AFE/Gate_Strobe3 (DD1C.6)
Gate_STR1_o: AFE/CPLD4 (DD18D.64), AFE/Gate_Strobe4 (DD1D.6)
Gate_STR1_o: AFE/CPLD5 (DD18E.64), AFE/Gate_Strobe5 (DD1E.6)
Gate_STR1_o: AFE/CPLD6 (DD18F.64), AFE/Gate_Strobe6 (DD1F.6)
Gate_STR1_o: AFE/CPLD7 (DD18G.64), AFE/Gate_Strobe7 (DD1G.6)
Gate_STR1_o: AFE/CPLD8 (DD18H.64), AFE/Gate_Strobe8 (DD1H.6)
Gate_STR1_o: AFE/CPLD9 (DD18I.64), AFE/Gate_Strobe9 (DD1I.6)
Gate_STR1_o: AFE/CPLD10 (DD18J.64), AFE/Gate_Strobe10 (DD1J.6)
Gate_STR1_o: AFE/CPLD11 (DD18K.64), AFE/Gate_Strobe11 (DD1K.6)
Gate_STR1_o: AFE/CPLD12 (DD18L.64), AFE/Gate_Strobe12 (DD1L.6)
GBT_RX_N: PM12_CONN (DD8.12), FPGA_I_J (DD6.R3)
GBT_RX_P: PM12_CONN (DD8.13), FPGA_I_J (DD6.R4)
GBT_TX_N: PM12_CONN (DD8.19), FPGA_I_J (DD6.P1)
GBT_TX_P: PM12_CONN (DD8.18), FPGA_I_J (DD6.P2)
HCLK: PM12_ATxmega128 (DD5.6), THS788_1 (DD4.34), THS788_3 (DD25.34), THS788_2 (DD24.34)
HDATA: PM12_ATxmega128 (DD5.7), THS788_1 (DD4.33), THS788_3 (DD25.33), THS788_2 (DD24.33)
HMISO: PM12_CONN (DD29.2), PM12_ATxmega128 (DD5.32), FPGA_C (DD6.F24)
HMOSI: PM12_CONN (DD28.2), PM12_ATxmega128 (DD5.31), FPGA_C (DD6.F25)
HSCK: PM12_CONN (DD28.5), PM12_ATxmega128 (DD5.33), FPGA_C (DD6.G22)
HSEL: PM12_CONN (DD28.7), PM12_ATxmega128 (DD5.30), FPGA_C (DD6.G26)
HSTROBE1: PM12_ATxmega128 (DD5.8), THS788_1 (DD4.41)
HSTROBE2: PM12_ATxmega128 (DD5.9), THS788_2 (DD24.41)
HSTROBE3: PM12_ATxmega128 (DD5.10), THS788_3 (DD25.41)
IN_PWR_OK: PM12_ATxmega128 (DD5.37 R109.1), PM12_LDO (DA21.3), PM12_Supply_LED (DD30.1 DD30.2 DD30.3)
INTA_G_DRV: AFE/INT1 (DD14A.2), AFE/CPLD1 (DD18A.53)
INTA_G_DRV: AFE/INT2 (DD14B.2), AFE/CPLD2 (DD18B.53)
INTA_G_DRV: AFE/INT3 (DD14C.2), AFE/CPLD3 (DD18C.53)
INTA_G_DRV: AFE/INT4 (DD14D.2), AFE/CPLD4 (DD18D.53)
INTA_G_DRV: AFE/INT5 (DD14E.2), AFE/CPLD5 (DD18E.53)
INTA_G_DRV: AFE/INT6 (DD14F.2), AFE/CPLD6 (DD18F.53)
INTA_G_DRV: AFE/INT7 (DD14G.2), AFE/CPLD7 (DD18G.53)
INTA_G_DRV: AFE/INT8 (DD14H.2), AFE/CPLD8 (DD18H.53)
INTA_G_DRV: AFE/INT9 (DD14I.2), AFE/CPLD9 (DD18I.53)
INTA_G_DRV: AFE/INT10 (DD14J.2), AFE/CPLD10 (DD18J.53)
INTA_G_DRV: AFE/INT11 (DD14K.2), AFE/CPLD11 (DD18K.53)
INTA_G_DRV: AFE/INT12 (DD14L.2), AFE/CPLD12 (DD18L.53)
INTB_G_DRV: AFE/INT1 (DD16A.2), AFE/CPLD1 (DD18A.54), AFE/ADC_PLL1 (DD20A.1)
INTB_G_DRV: AFE/INT2 (DD16B.2), AFE/CPLD2 (DD18B.54), AFE/ADC_PLL2 (DD20B.1)
INTB_G_DRV: AFE/INT3 (DD16C.2), AFE/CPLD3 (DD18C.54), AFE/ADC_PLL3 (DD20C.1)
INTB_G_DRV: AFE/INT4 (DD16D.2), AFE/CPLD4 (DD18D.54), AFE/ADC_PLL4 (DD20D.1)
INTB_G_DRV: AFE/INT5 (DD16E.2), AFE/CPLD5 (DD18E.54), AFE/ADC_PLL5 (DD20E.1)
INTB_G_DRV: AFE/INT6 (DD16F.2), AFE/CPLD6 (DD18F.54), AFE/ADC_PLL6 (DD20F.1)
INTB_G_DRV: AFE/INT7 (DD16G.2), AFE/CPLD7 (DD18G.54), AFE/ADC_PLL7 (DD20G.1)
INTB_G_DRV: AFE/INT8 (DD16H.2), AFE/CPLD8 (DD18H.54), AFE/ADC_PLL8 (DD20H.1)
INTB_G_DRV: AFE/INT9 (DD16I.2), AFE/CPLD9 (DD18I.54), AFE/ADC_PLL9 (DD20I.1)
INTB_G_DRV: AFE/INT10 (DD16J.2), AFE/CPLD10 (DD18J.54), AFE/ADC_PLL10 (DD20J.1)
INTB_G_DRV: AFE/INT11 (DD16K.2), AFE/CPLD11 (DD18K.54), AFE/ADC_PLL11 (DD20K.1)
INTB_G_DRV: AFE/INT12 (DD16L.2), AFE/CPLD12 (DD18L.54), AFE/ADC_PLL12 (DD20L.1)
IRQ: PM12_ATxmega128 (DD5.36), FPGA_C (DD6.J26)
LACK2: FPGA_E (X13.3), FPGA_C (DD6.B20)
MCLK1_N: ADCLK (DD27.17), FPGA_H (DD6.AA2), THS788_1 (DD4.56)
MCLK1_P: ADCLK (DD27.18), FPGA_H (DD6.AA3), THS788_1 (DD4.57)
MCLK2_N: ADCLK (DD27.20), FPGA_G (DD6.AB9), THS788_2 (DD24.56)
MCLK2_P: ADCLK (DD27.21), FPGA_G (DD6.AA9), THS788_2 (DD24.57)
MCLK3_N: ADCLK (DD27.23), FPGA_D_F (DD6.AC16), THS788_3 (DD25.56)
MCLK3_P: ADCLK (DD27.24), FPGA_D_F (DD6.AB16), THS788_3 (DD25.57)
MCU_Console_CTS: PM12_CONN (DD7.9), PM12_ATxmega128 (DD5.47)
MCU_Console_RTS: PM12_CONN (DD7.10), PM12_ATxmega128 (DD5.46)
MCU_Console_Rx: PM12_CONN (DD7.12), PM12_ATxmega128 (DD5.48)
MCU_Console_Tx: PM12_CONN (DD7.11), PM12_ATxmega128 (DD5.49)
N5V0_CFD: AFE/INT1 (8 pins), AFE/QDC1 (X2A.8)
N5V0_CFD: AFE/INT2 (8 pins), AFE/QDC2 (X2B.8)
N5V0_CFD: AFE/INT3 (8 pins), AFE/QDC3 (X2C.8)
N5V0_CFD: AFE/INT4 (8 pins), AFE/QDC4 (X2D.8)
N5V0_CFD: AFE/INT5 (8 pins), AFE/QDC5 (X2E.8)
N5V0_CFD: AFE/INT6 (8 pins), AFE/QDC6 (X2F.8)
N5V0_CFD: AFE/INT7 (8 pins), AFE/QDC7 (X2G.8)
N5V0_CFD: AFE/INT8 (8 pins), AFE/QDC8 (X2H.8)
N5V0_CFD: AFE/INT9 (8 pins), AFE/QDC9 (X2I.8)
N5V0_CFD: AFE/INT10 (8 pins), AFE/QDC10 (X2J.8)
N5V0_CFD: AFE/INT11 (8 pins), AFE/QDC11 (X2K.8)
N5V0_CFD: AFE/INT12 (8 pins), AFE/QDC12 (X2L.8)
OVERTEMPn: PM12_ATxmega128 (DA27.6 R151.1), PM12_Supply_LED (DD30.4)
P1V0_PG: PM12_Supply_LED (DD11.4 DD30.5), PM12_P1V0 (DA11.17 R79.1)
P1V2LDO_PG: PM12_ATxmega128 (DD5.39 R112.1), PM12_Supply_LED (7 pins), PM12_P3V8 (DA23.17), PM12_N5V5 (DA8.11), PM12_P5V5 (DA7.11)
P1V8_PG: PM12_Supply_LED (DD11.13 DD30.12), PM12_P1V8 (DA12.17 R89.1)
P3V3_PG: PM12_Supply_LED (5 pins), PM12_P3V3 (DA13.17)
P3V3_QDC: AFE/ADC1 (10 pins), AFE/QDC1 (C90A.2 DA22A.4), AFE/Gate_Strobe1 (C87A.1 DA26A.3)
P3V3_QDC: AFE/ADC2 (10 pins), AFE/QDC2 (C90B.2 DA22B.4), AFE/Gate_Strobe2 (C87B.1 DA26B.3)
P3V3_QDC: AFE/ADC3 (10 pins), AFE/QDC3 (C90C.2 DA22C.4), AFE/Gate_Strobe3 (C87C.1 DA26C.3)
P3V3_QDC: AFE/ADC4 (10 pins), AFE/QDC4 (C90D.2 DA22D.4), AFE/Gate_Strobe4 (C87D.1 DA26D.3)
P3V3_QDC: AFE/ADC5 (10 pins), AFE/QDC5 (C90E.2 DA22E.4), AFE/Gate_Strobe5 (C87E.1 DA26E.3)
P3V3_QDC: AFE/ADC6 (10 pins), AFE/QDC6 (C90F.2 DA22F.4), AFE/Gate_Strobe6 (C87F.1 DA26F.3)
P3V3_QDC: AFE/ADC7 (10 pins), AFE/QDC7 (C90G.2 DA22G.4), AFE/Gate_Strobe7 (C87G.1 DA26G.3)
P3V3_QDC: AFE/ADC8 (10 pins), AFE/QDC8 (C90H.2 DA22H.4), AFE/Gate_Strobe8 (C87H.1 DA26H.3)
P3V3_QDC: AFE/ADC9 (10 pins), AFE/QDC9 (C90I.2 DA22I.4), AFE/Gate_Strobe9 (C87I.1 DA26I.3)
P3V3_QDC: AFE/ADC10 (10 pins), AFE/QDC10 (C90J.2 DA22J.4), AFE/Gate_Strobe10 (C87J.1 DA26J.3)
P3V3_QDC: AFE/ADC11 (10 pins), AFE/QDC11 (C90K.2 DA22K.4), AFE/Gate_Strobe11 (C87K.1 DA26K.3)
P3V3_QDC: AFE/ADC12 (10 pins), AFE/QDC12 (C90L.2 DA22L.4), AFE/Gate_Strobe12 (C87L.1 DA26L.3)
P5V0_CFD: AFE/INT1 (13 pins), AFE/QDC1 (5 pins), AFE/ADC_PLL1 (R123A.1)
P5V0_CFD: AFE/INT2 (13 pins), AFE/QDC2 (5 pins), AFE/ADC_PLL2 (R123B.1)
P5V0_CFD: AFE/INT3 (13 pins), AFE/QDC3 (5 pins), AFE/ADC_PLL3 (R123C.1)
P5V0_CFD: AFE/INT4 (13 pins), AFE/QDC4 (5 pins), AFE/ADC_PLL4 (R123D.1)
P5V0_CFD: AFE/INT5 (13 pins), AFE/QDC5 (5 pins), AFE/ADC_PLL5 (R123E.1)
P5V0_CFD: AFE/INT6 (13 pins), AFE/QDC6 (5 pins), AFE/ADC_PLL6 (R123F.1)
P5V0_CFD: AFE/INT7 (13 pins), AFE/QDC7 (5 pins), AFE/ADC_PLL7 (R123G.1)
P5V0_CFD: AFE/INT8 (13 pins), AFE/QDC8 (5 pins), AFE/ADC_PLL8 (R123H.1)
P5V0_CFD: AFE/INT9 (13 pins), AFE/QDC9 (5 pins), AFE/ADC_PLL9 (R123I.1)
P5V0_CFD: AFE/INT10 (13 pins), AFE/QDC10 (5 pins), AFE/ADC_PLL10 (R123J.1)
P5V0_CFD: AFE/INT11 (13 pins), AFE/QDC11 (5 pins), AFE/ADC_PLL11 (R123K.1)
P5V0_CFD: AFE/INT12 (13 pins), AFE/QDC12 (5 pins), AFE/ADC_PLL12 (R123L.1)
PLL_CLK0_N: Main_PLL (DD3.28), ADCLK (DD19.2 R127.1)
PLL_CLK0_N: ADCLK (DD19.31), AFE/ADC_PLL7 (DD2G.4)
PLL_CLK0_N: ADCLK (DD19.33), AFE/ADC_PLL8 (DD2H.4)
PLL_CLK0_N: ADCLK (DD19.39), AFE/ADC_PLL9 (DD2I.4)
PLL_CLK0_N: ADCLK (DD19.41), AFE/ADC_PLL10 (DD2J.4)
PLL_CLK0_N: ADCLK (DD19.45), AFE/ADC_PLL11 (DD2K.4)
PLL_CLK0_N: ADCLK (DD19.47), AFE/ADC_PLL12 (DD2L.4)
PLL_CLK0_N: ADCLK (DD19.27), AFE/ADC_PLL6 (DD2F.4)
PLL_CLK0_N: ADCLK (DD19.25), AFE/ADC_PLL5 (DD2E.4)
PLL_CLK0_N: ADCLK (DD19.21), AFE/ADC_PLL4 (DD2D.4)
PLL_CLK0_N: ADCLK (DD19.19), AFE/ADC_PLL3 (DD2C.4)
PLL_CLK0_N: ADCLK (DD19.15), AFE/ADC_PLL2 (DD2B.4)
PLL_CLK0_N: ADCLK (DD19.8), AFE/ADC_PLL1 (DD2A.4)
PLL_CLK0_P: Main_PLL (DD3.27), ADCLK (DD19.3 R127.2)
PLL_CLK0_P: ADCLK (DD19.32), AFE/ADC_PLL7 (DD2G.3)
PLL_CLK0_P: ADCLK (DD19.34), AFE/ADC_PLL8 (DD2H.3)
PLL_CLK0_P: ADCLK (DD19.40), AFE/ADC_PLL9 (DD2I.3)
PLL_CLK0_P: ADCLK (DD19.42), AFE/ADC_PLL10 (DD2J.3)
PLL_CLK0_P: ADCLK (DD19.46), AFE/ADC_PLL11 (DD2K.3)
PLL_CLK0_P: ADCLK (DD19.48), AFE/ADC_PLL12 (DD2L.3)
PLL_CLK0_P: ADCLK (DD19.28), AFE/ADC_PLL6 (DD2F.3)
PLL_CLK0_P: ADCLK (DD19.26), AFE/ADC_PLL5 (DD2E.3)
PLL_CLK0_P: ADCLK (DD19.22), AFE/ADC_PLL4 (DD2D.3)
PLL_CLK0_P: ADCLK (DD19.20), AFE/ADC_PLL3 (DD2C.3)
PLL_CLK0_P: ADCLK (DD19.16), AFE/ADC_PLL2 (DD2B.3)
PLL_CLK0_P: ADCLK (DD19.9), AFE/ADC_PLL1 (DD2A.3)
PLL_CLK3_N: Main_PLL (DD3.10), FPGA_I_J (C70.1)
PLL_CLK3_P: Main_PLL (DD3.9), FPGA_I_J (C69.1)